# EAGLE design CDH-v4.11-A-DS1338-tcc-test-redesign (EAGLE 7.2.0)
sdf
DRAWING_AUTHOR: Lambert Le
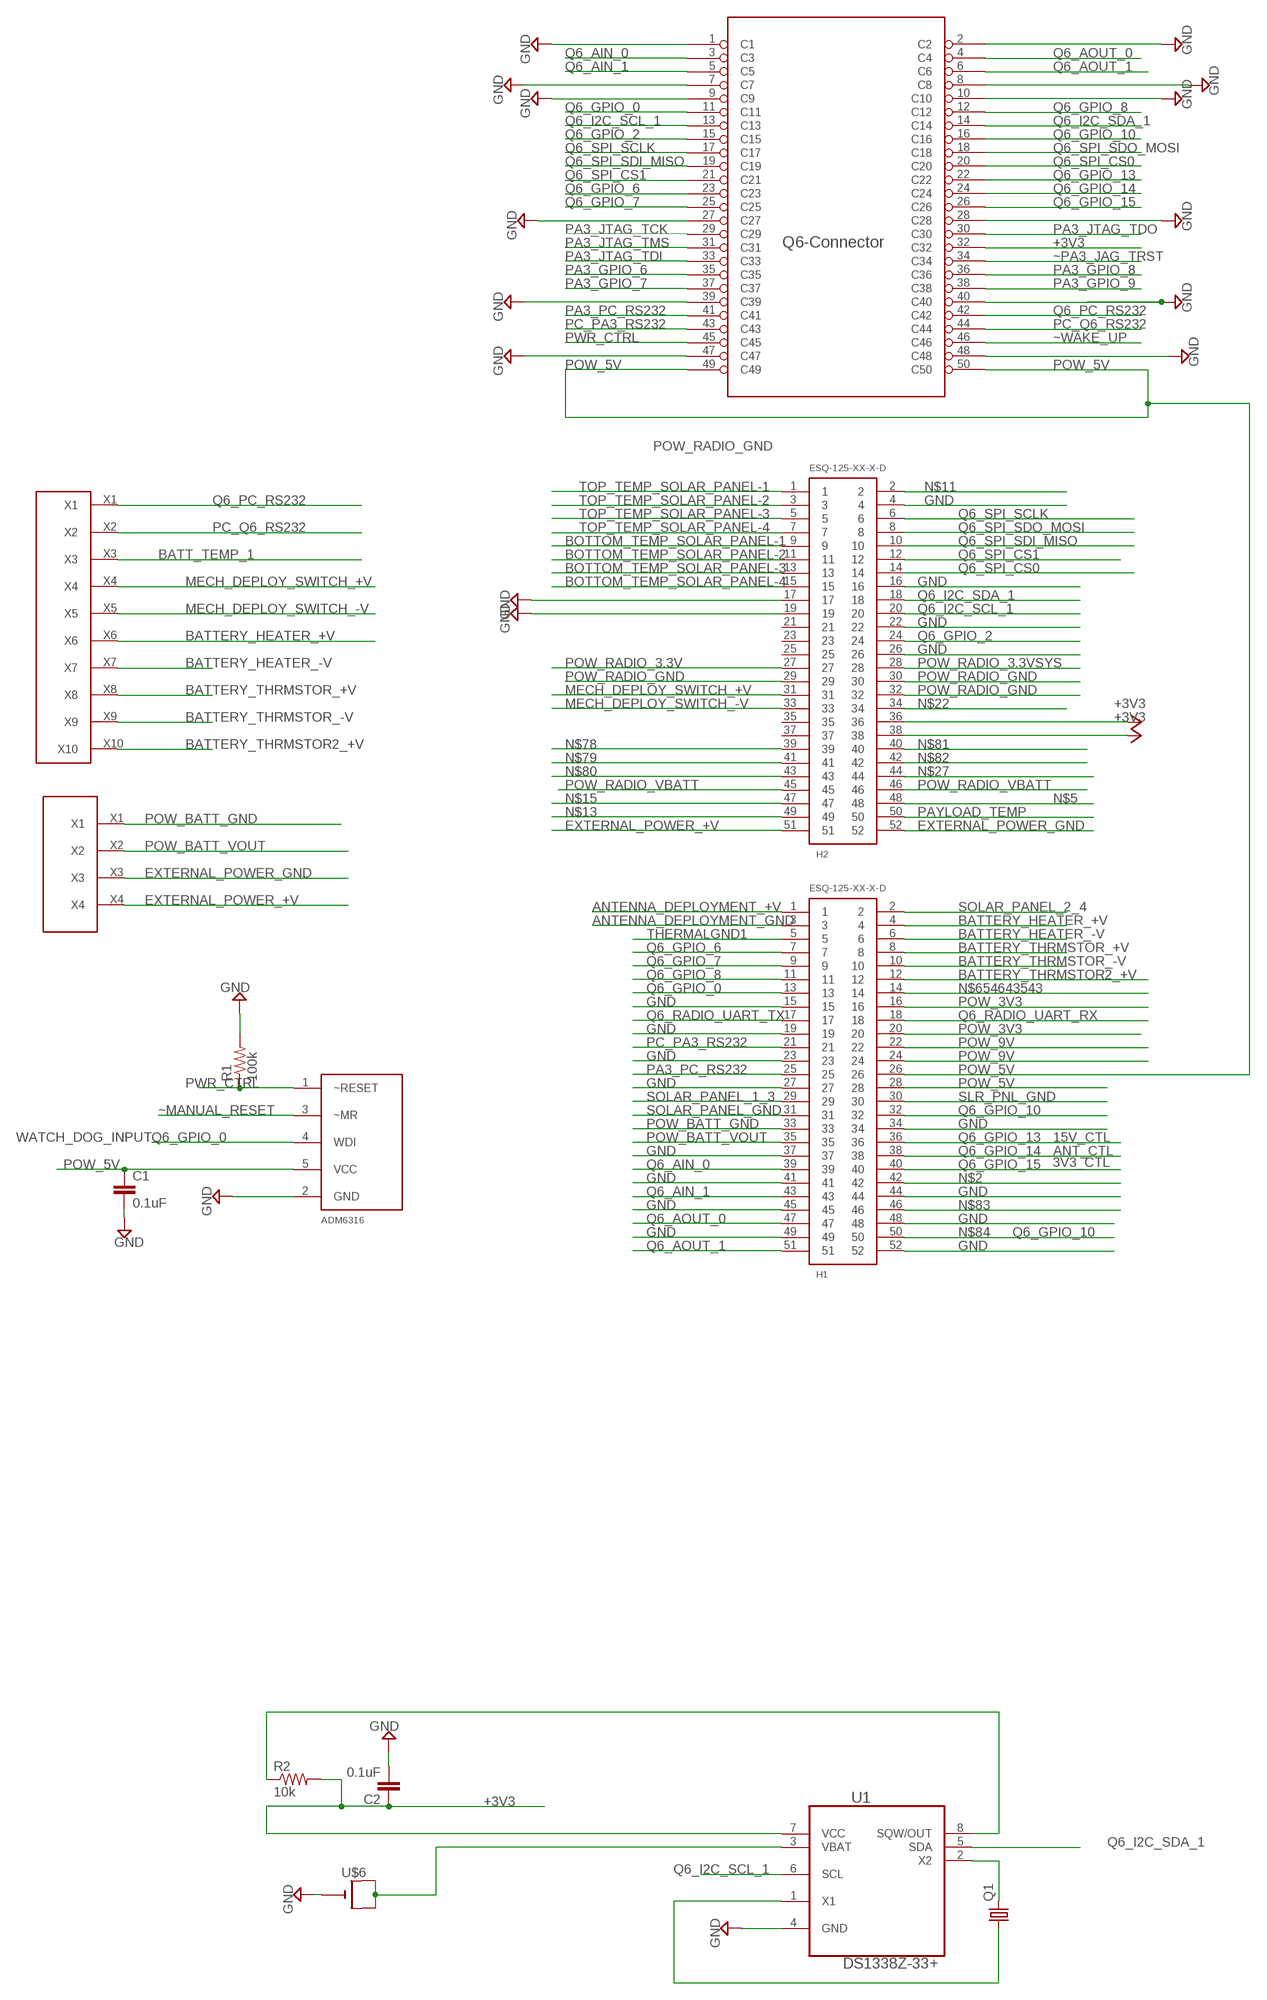
[diagram p0: schematic, sheet 1, part 1 of 2]
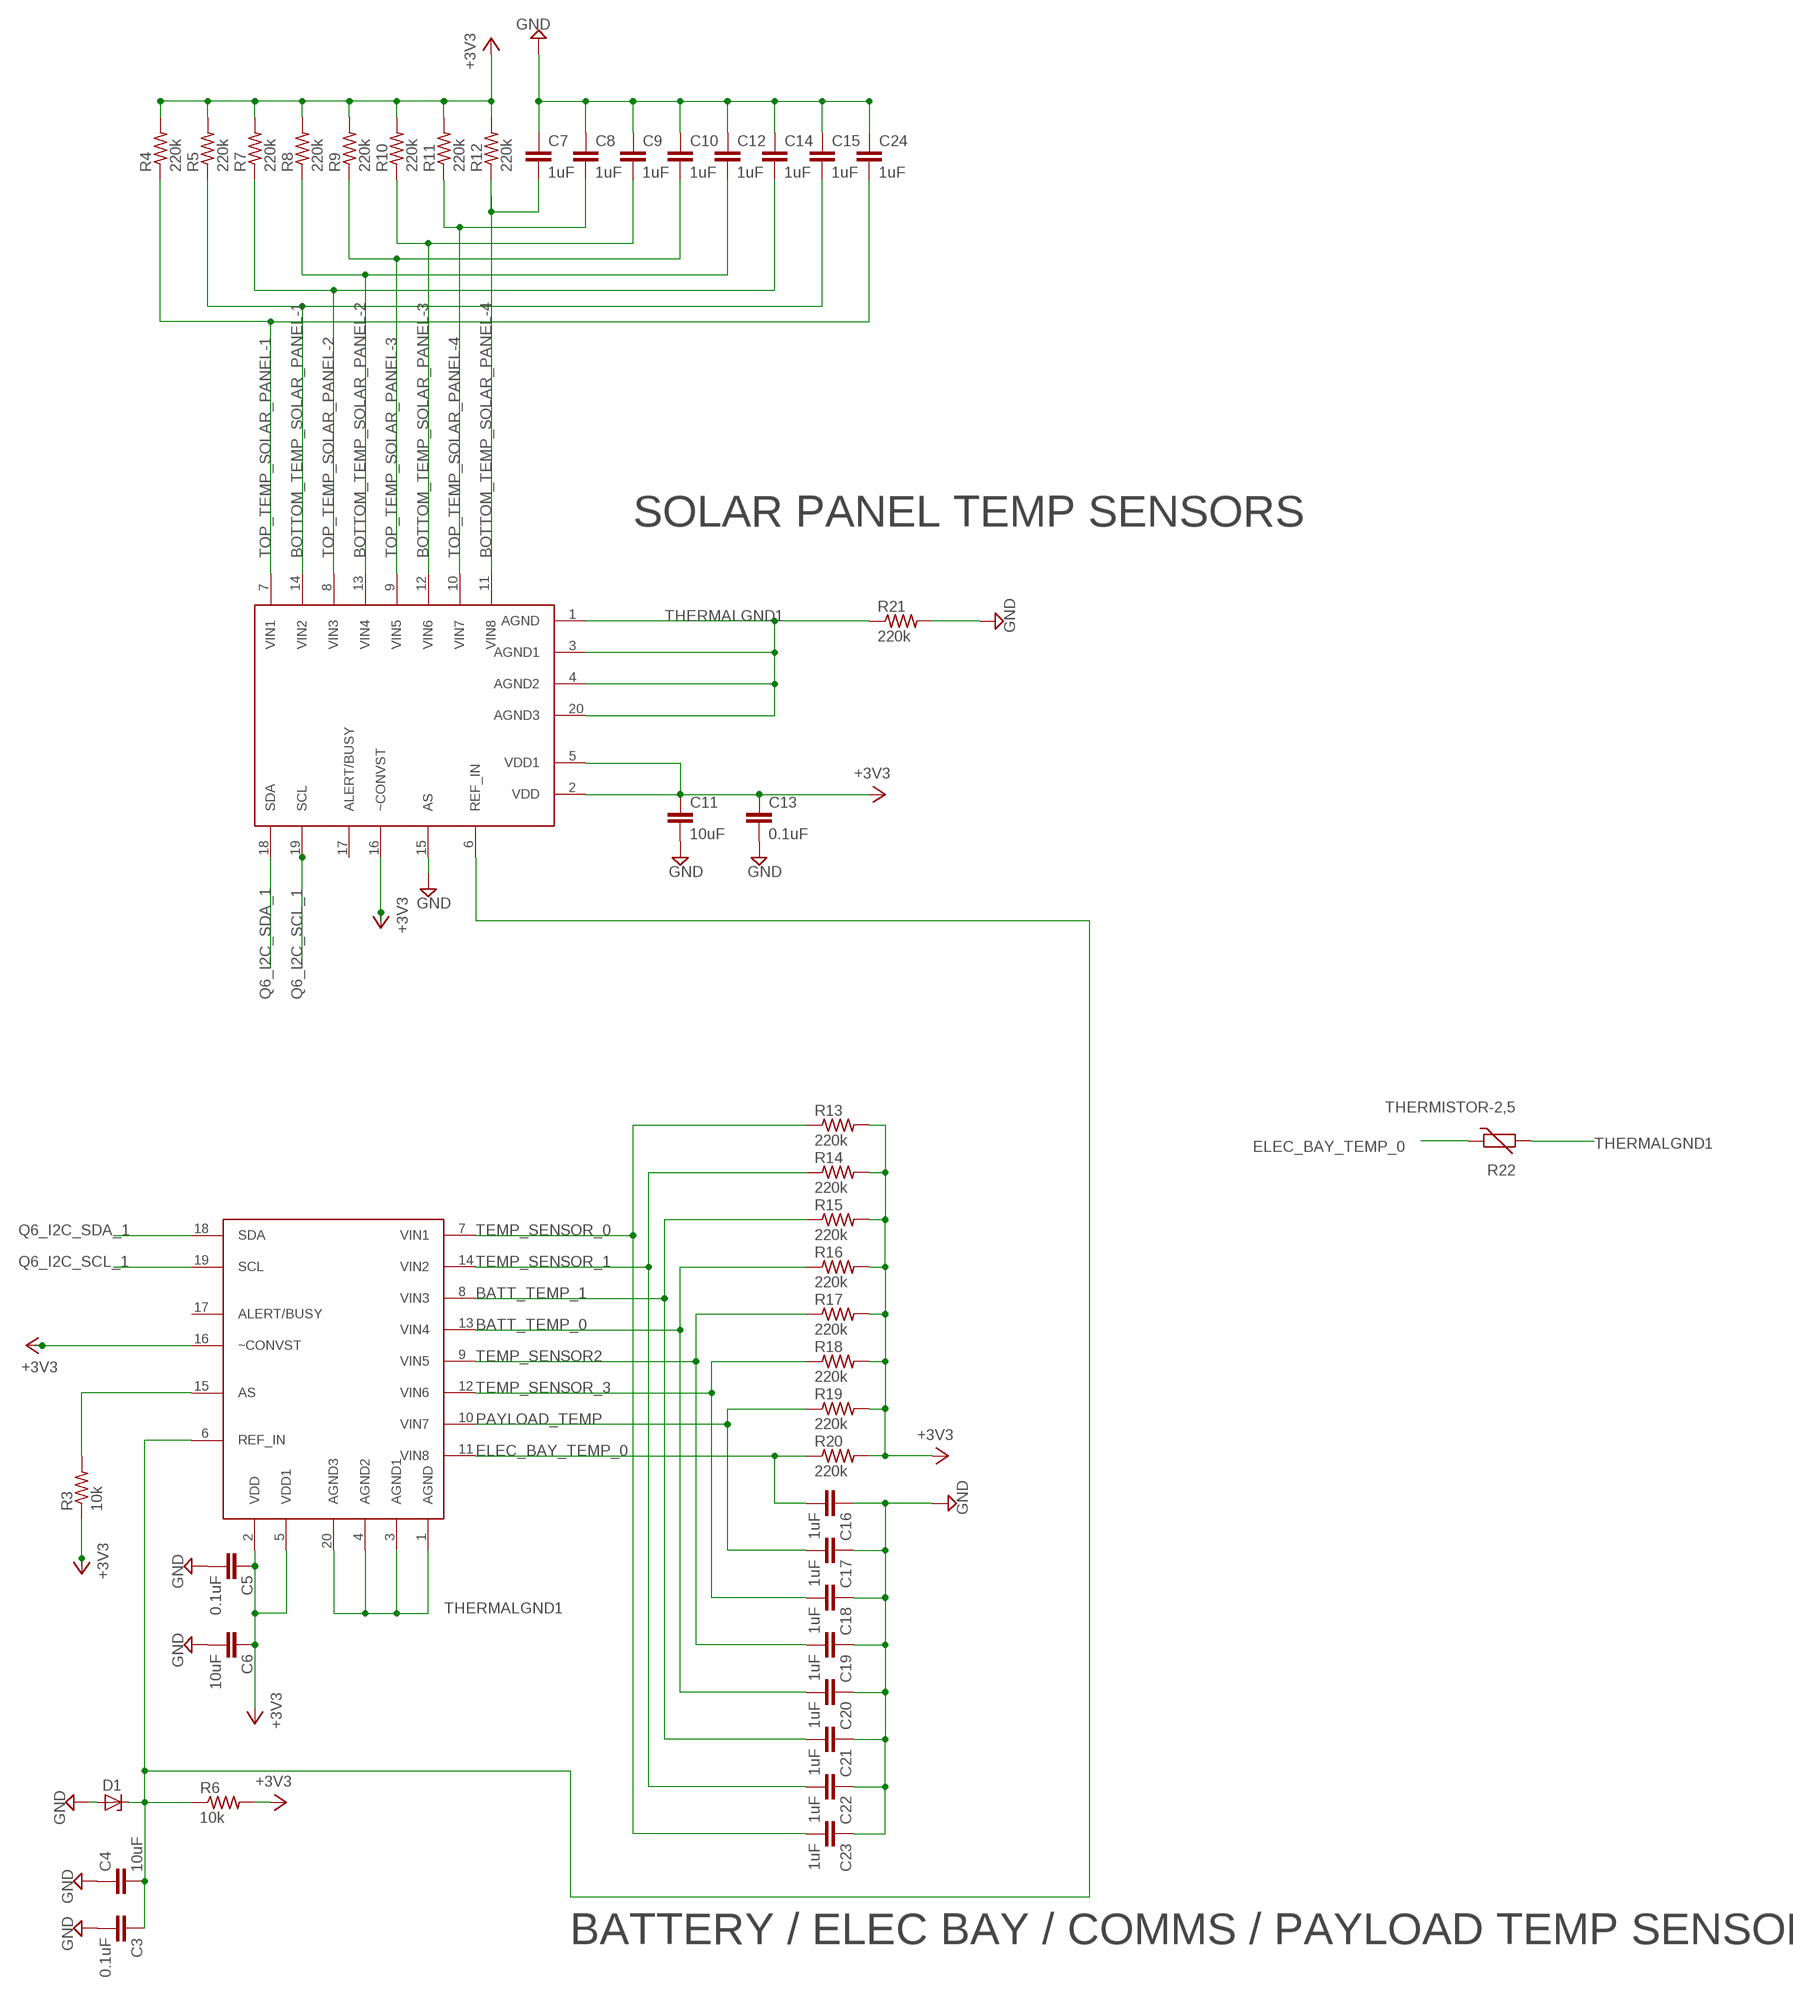
[diagram p1: schematic, sheet 1, part 2 of 2]

## Parts
ADC_TEMP_1  AD7998-1  [TSSOP20]
ADC_TEMP_2  AD7998-1  [TSSOP20]
C1  0.1uF  C-EUC2012  [C2012]
C2  0.1uF  C-EUC2012  [C2012]
C3  0.1uF  C-EUC2012  [C2012]
C4  10uF  C-EUC2012  [C2012]
C5  0.1uF  C-EUC2012  [C2012]
C6  10uF  C-EUC2012  [C2012]
C7  1uF  C-EUC2012  [C2012]
C8  1uF  C-EUC2012  [C2012]
C9  1uF  C-EUC2012  [C2012]
C10  1uF  C-EUC2012  [C2012]
C11  10uF  C-EUC2012  [C2012]
C12  1uF  C-EUC2012  [C2012]
C13  0.1uF  C-EUC2012  [C2012]
C14  1uF  C-EUC2012  [C2012]
C15  1uF  C-EUC2012  [C2012]
C16  1uF  C-EUC2012  [C2012]
C17  1uF  C-EUC2012  [C2012]
C18  1uF  C-EUC2012  [C2012]
C19  1uF  C-EUC2012  [C2012]
C20  1uF  C-EUC2012  [C2012]
C21  1uF  C-EUC2012  [C2012]
C22  1uF  C-EUC2012  [C2012]
C23  1uF  C-EUC2012  [C2012]
C24  1uF  C-EUC2012  [C2012]
D1  ZENER-DIODESOD80C  [SOD80C]
H1  ESQ-125-XX-X-D  [ESQ-125-XX-X-D]
H2  ESQ-125-XX-X-D  [ESQ-125-XX-X-D]
Q1  CRYSTALTC38H  [TC38H]
R1  100k  R-US_R2012  [R2012]
R2  10k  R-US_R2012  [R2012]
R3  10k  R-US_R2012  [R2012]
R4  220k  R-US_R2012  [R2012]
R5  220k  R-US_R2012  [R2012]
R6  10k  R-US_R2012  [R2012]
R7  220k  R-US_R2012  [R2012]
R8  220k  R-US_R2012  [R2012]
R9  220k  R-US_R2012  [R2012]
R10  220k  R-US_R2012  [R2012]
R11  220k  R-US_R2012  [R2012]
R12  220k  R-US_R2012  [R2012]
R13  220k  R-US_R2012  [R2012]
R14  220k  R-US_R2012  [R2012]
R15  220k  R-US_R2012  [R2012]
R16  220k  R-US_R2012  [R2012]
R17  220k  R-US_R2012  [R2012]
R18  220k  R-US_R2012  [R2012]
R19  220k  R-US_R2012  [R2012]
R20  220k  R-US_R2012  [R2012]
R21  220k  R-US_R2012  [R2012]
R22  THERMISTOR-2,5  [RS-2,5]
U1  DS1338Z-33+  [SOIC127P600X175-8N]
U$1  M80-5000000M1-10-331-00-000  [M80-5000000M1-04-331-00-000]
U$2  M80-5000000M1-10-331-000  [M80-5000000M1]
U$3  ADM6316/ADM6320  [SOT23-5]
U$4  SMFC  [SFMC-107-01-XX-D]
U$6  CR1220SMT  [CR1220-SMD]

## Nets
+3V3: ADC_TEMP_1.2(VDD) ADC_TEMP_1.5(VDD1) ADC_TEMP_1.16(~CONVST) ADC_TEMP_2.2(VDD) ADC_TEMP_2.5(VDD1) ADC_TEMP_2.16(~CONVST) C2.1 C5.1 C6.1 C11.1 C13.1 H2.36 H2.38 R2.2 R3.1 R4.2 R5.2 R6.2 R7.2 R8.2 R9.2 R10.2 R11.2 R12.2 R13.2 R14.2 R15.2 R16.2 R17.2 R18.2 R19.2 R20.2 U1.7(VCC) U$4.32(C32)
ANTENNA_DEPLOYMENT_+V: H1.1
ANTENNA_DEPLOYMENT_GND: H1.3
BATT_TEMP_0: ADC_TEMP_1.13(VIN4) C20.2 R16.1
BATT_TEMP_1: ADC_TEMP_1.8(VIN3) C21.2 R15.1 U$2.X3
BATTERY_HEATER_+V: H1.4 U$2.X6
BATTERY_HEATER_-V: H1.6 U$2.X7
BATTERY_THRMSTOR2_+V: H1.12 U$2.X10
BATTERY_THRMSTOR_+V: H1.8 U$2.X8
BATTERY_THRMSTOR_-V: H1.10 U$2.X9
BOTTOM_TEMP_SOLAR_PANEL-1: ADC_TEMP_2.14(VIN2) C15.2 H2.9 R5.1
BOTTOM_TEMP_SOLAR_PANEL-2: ADC_TEMP_2.13(VIN4) C12.2 H2.11 R8.1
BOTTOM_TEMP_SOLAR_PANEL-3: ADC_TEMP_2.12(VIN6) C9.2 H2.13 R10.1
BOTTOM_TEMP_SOLAR_PANEL-4: ADC_TEMP_2.11(VIN8) C7.2 H2.15 R12.1
ELEC_BAY_TEMP_0: ADC_TEMP_1.11(VIN8) C16.2 R20.1 R22.1
EXTERNAL_POWER_+V: H2.51 U$1.X4
EXTERNAL_POWER_GND: H2.52 U$1.X3
GND: ADC_TEMP_2.15(AS) C1.2 C2.2 C3.2 C4.1 C5.2 C6.2 C7.1 C8.1 C9.1 C10.1 C11.2 C12.1 C13.2 C14.1 C15.1 C16.1 C17.1 C18.1 C19.1 C20.1 C21.1 C22.1 C23.1 C24.1 D1.A H1.15 H1.19 H1.23 H1.27 H1.34 H1.37 H1.41 H1.44 H1.45 H1.48 H1.49 H1.52 H2.4 H2.16 H2.17 H2.19 H2.22 H2.26 R1.2 R21.2 U1.4(GND) U$3.2(GND) U$4.1(C1) U$4.2(C2) U$4.7(C7) U$4.8(C8) U$4.9(C9) U$4.10(C10) U$4.27(C27) U$4.28(C28) U$4.39(C39) U$4.40(C40) U$4.47(C47) U$4.48(C48) U$6.-
MECH_DEPLOY_SWITCH_+V: H2.31 U$2.X4
MECH_DEPLOY_SWITCH_-V: H2.33 U$2.X5
N$2: H1.42
N$3: ADC_TEMP_1.15(AS) R3.2
N$5: H2.48
N$7: R2.1 U1.8(SQW/OUT)
N$8: U1.3(VBAT) U$6.+$1(+) U$6.+$2(+1)
N$11: H2.2
N$12: Q1.1 U1.1(X1)
N$13: H2.49
N$15: H2.47
N$18: Q1.2 U1.2(X2)
N$22: H2.34
N$27: H2.44
N$78: H2.39
N$79: H2.41
N$80: H2.43
N$81: H2.40
N$82: H2.42
N$83: H1.46
N$84: H1.50
N$654643543: H1.14
PA3_GPIO_6: U$4.35(C35)
PA3_GPIO_7: U$4.37(C37)
PA3_GPIO_8: U$4.36(C36)
PA3_GPIO_9: U$4.38(C38)
PA3_JTAG_TCK: U$4.29(C29)
PA3_JTAG_TDI: U$4.33(C33)
PA3_JTAG_TDO: U$4.30(C30)
PA3_JTAG_TMS: U$4.31(C31)
PA3_PC_RS232: H1.25 U$4.41(C41)
PAYLOAD_TEMP: ADC_TEMP_1.10(VIN7) C17.2 H2.50 R19.1
PC_PA3_RS232: H1.21 U$4.43(C43)
PC_Q6_RS232: U$2.X2 U$4.44(C44)
POW_3V3: H1.16 H1.20
POW_5V: C1.1 H1.26 H1.28 U$3.5(VCC) U$4.49(C49) U$4.50(C50)
POW_9V: H1.22 H1.24
POW_BATT_GND: H1.33 U$1.X1
POW_BATT_VOUT: H1.35 U$1.X2
POW_RADIO_3.3V: H2.27
POW_RADIO_3.3VSYS: H2.28
POW_RADIO_GND: H2.29 H2.30 H2.32
POW_RADIO_VBATT: H2.45 H2.46
PWR_CTRL: R1.1 U$3.1(~RESET) U$4.45(C45)
Q6_AIN_0: H1.39 U$4.3(C3)
Q6_AIN_1: H1.43 U$4.5(C5)
Q6_AOUT_0: H1.47 U$4.4(C4)
Q6_AOUT_1: H1.51 U$4.6(C6)
Q6_GPIO_0: H1.13 U$3.4(WDI) U$4.11(C11)
Q6_GPIO_2: H2.24 U$4.15(C15)
Q6_GPIO_6: H1.7 U$4.23(C23)
Q6_GPIO_7: H1.9 U$4.25(C25)
Q6_GPIO_8: H1.11 U$4.12(C12)
Q6_GPIO_10: H1.32 U$4.16(C16)
Q6_GPIO_13: H1.36 U$4.22(C22)
Q6_GPIO_14: H1.38 U$4.24(C24)
Q6_GPIO_15: H1.40 U$4.26(C26)
Q6_I2C_SCL_1: ADC_TEMP_1.19(SCL) ADC_TEMP_2.19(SCL) H2.20 U1.6(SCL) U$4.13(C13)
Q6_I2C_SDA_1: ADC_TEMP_1.18(SDA) ADC_TEMP_2.18(SDA) H2.18 U1.5(SDA) U$4.14(C14)
Q6_PC_RS232: U$2.X1 U$4.42(C42)
Q6_RADIO_UART_RX: H1.18
Q6_RADIO_UART_TX: H1.17
Q6_SPI_CS0: H2.14 U$4.20(C20)
Q6_SPI_CS1: H2.12 U$4.21(C21)
Q6_SPI_SCLK: H2.6 U$4.17(C17)
Q6_SPI_SDI_MISO: H2.10 U$4.19(C19)
Q6_SPI_SDO_MOSI: H2.8 U$4.18(C18)
REF_IN: ADC_TEMP_1.6(REF_IN) ADC_TEMP_2.6(REF_IN) C3.1 C4.2 D1.C R6.1
SLR_PNL_GND: H1.30
SOLAR_PANEL_1_3: H1.29
SOLAR_PANEL_2_4: H1.2
SOLAR_PANEL_GND: H1.31
TEMP_SENSOR2: ADC_TEMP_1.9(VIN5) C19.2 R17.1
TEMP_SENSOR_0: ADC_TEMP_1.7(VIN1) C23.2 R13.1
TEMP_SENSOR_1: ADC_TEMP_1.14(VIN2) C22.2 R14.1
TEMP_SENSOR_3: ADC_TEMP_1.12(VIN6) C18.2 R18.1
THERMALGND1: ADC_TEMP_1.1(AGND) ADC_TEMP_1.3(AGND1) ADC_TEMP_1.4(AGND2) ADC_TEMP_1.20(AGND3) ADC_TEMP_2.1(AGND) ADC_TEMP_2.3(AGND1) ADC_TEMP_2.4(AGND2) ADC_TEMP_2.20(AGND3) H1.5 R21.1 R22.2
TOP_TEMP_SOLAR_PANEL-1: ADC_TEMP_2.7(VIN1) C24.2 H2.1 R4.1
TOP_TEMP_SOLAR_PANEL-2: ADC_TEMP_2.8(VIN3) C14.2 H2.3 R7.1
TOP_TEMP_SOLAR_PANEL-3: ADC_TEMP_2.9(VIN5) C10.2 H2.5 R9.1
TOP_TEMP_SOLAR_PANEL-4: ADC_TEMP_2.10(VIN7) C8.2 H2.7 R11.1
~MANUAL_RESET: U$3.3(~MR)
~PA3_JAG_TRST: U$4.34(C34)
~WAKE_UP: U$4.46(C46)
Unconnected: ADC_TEMP_1.17(ALERT/BUSY) ADC_TEMP_2.17(ALERT/BUSY) H2.21 H2.23 H2.25 H2.35 H2.37

## Notes on the sheet
- Q6_AOUT_0
- Q6_AOUT_1
- Q6-Connector
- SOLAR PANEL TEMP SENSORS
- POW_RADIO_GND
- SOLAR_PANEL_2_4
- WATCH_DOG_INPUT | 15V_CTL
- ANT_CTL
- 3V3_CTL
- Q6_GPIO_10
- BATTERY / ELEC BAY / COMMS / PAYLOAD TEMP SENSORS

## Library data of the parts
ADC_TEMP_1 ADC_TEMP_2 = analog-devices:AD7998-1
C1-C24 = rcl:C-EU: CAPACITOR, European symbol
D1 = diode:ZENER-DIODE: Z-Diode
H1 H2 = ESQ-126-XX-X-D:ESQ-125-XX-X-D: ELEVATED SOCKET, .100 inch(2.54mm) PITCH
Q1 = adafruit:CRYSTAL: CRYSTAL; OC_FARNELL: unknown; OC_NEWARK: unknown
R1-R21 = resistor:R-US_: RESISTOR, American symbol
R22 = varistor:THERMISTOR: THERMISTOR
U1 = Maxim_By_element14_Batch_1:DS1338Z-33+: I2C RTC with 56-Byte NV RAM; MPN: DS1338Z-33+; OC_FARNELL: 1379714; OC_NEWARK: 27K7425; PACKAGE: SOIC-8; SUPPLIER: Maxim
U$1 = harwin:M80-5000000M1-10-331-00-000
U$2 = harwin:M80-5000000M1-10-331-000
U$3 = analog-devices:ADM6316/ADM6320
U$4 = SFMC-125-02-S-D:SMFC
U$6 = adafruit:CR1220: CR1216/CR1220/CR1225 12mm 3V lithium coin cell Great for battery packup. Both SMT and THM holders. Note the THM package has the ground pads on both sides of the PCB so that the masks are the same - this reduces the cost

## Net classes
0 default: width 0.406 mm

## Board
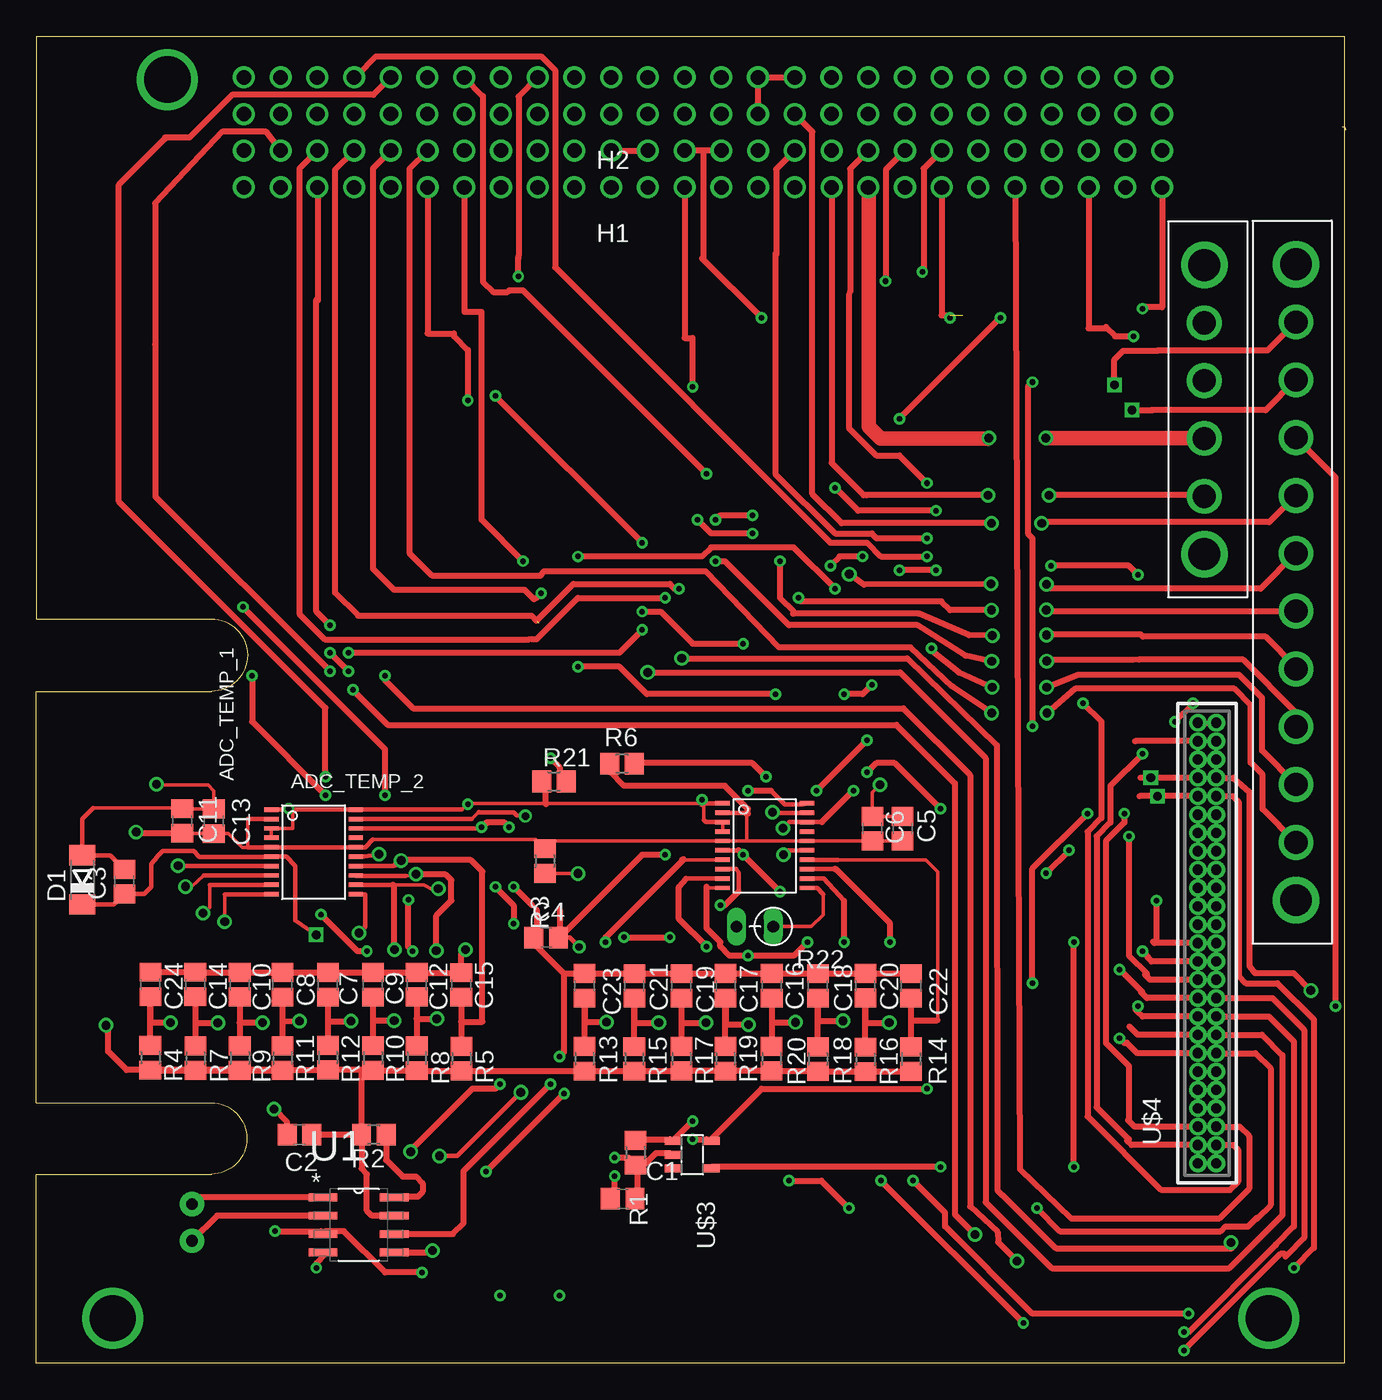
[diagram p2: board, top side]
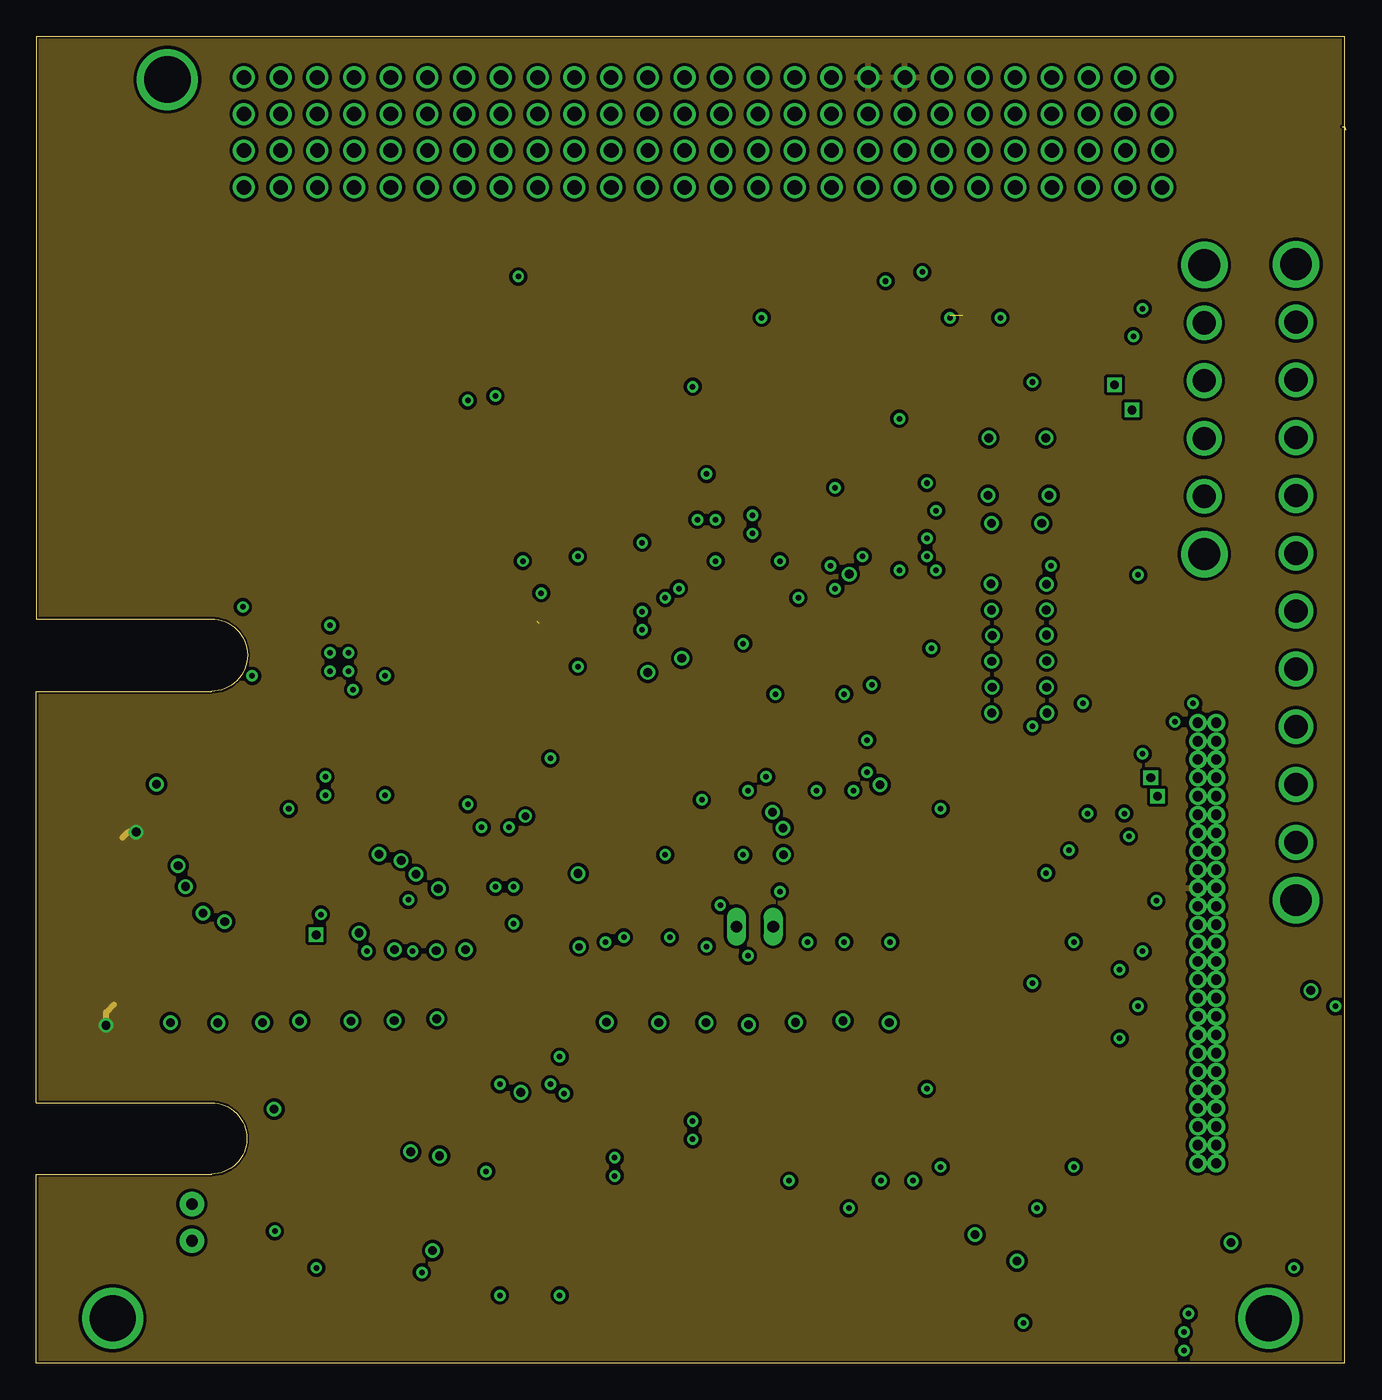
[diagram p3: board, inner layer +3V3]
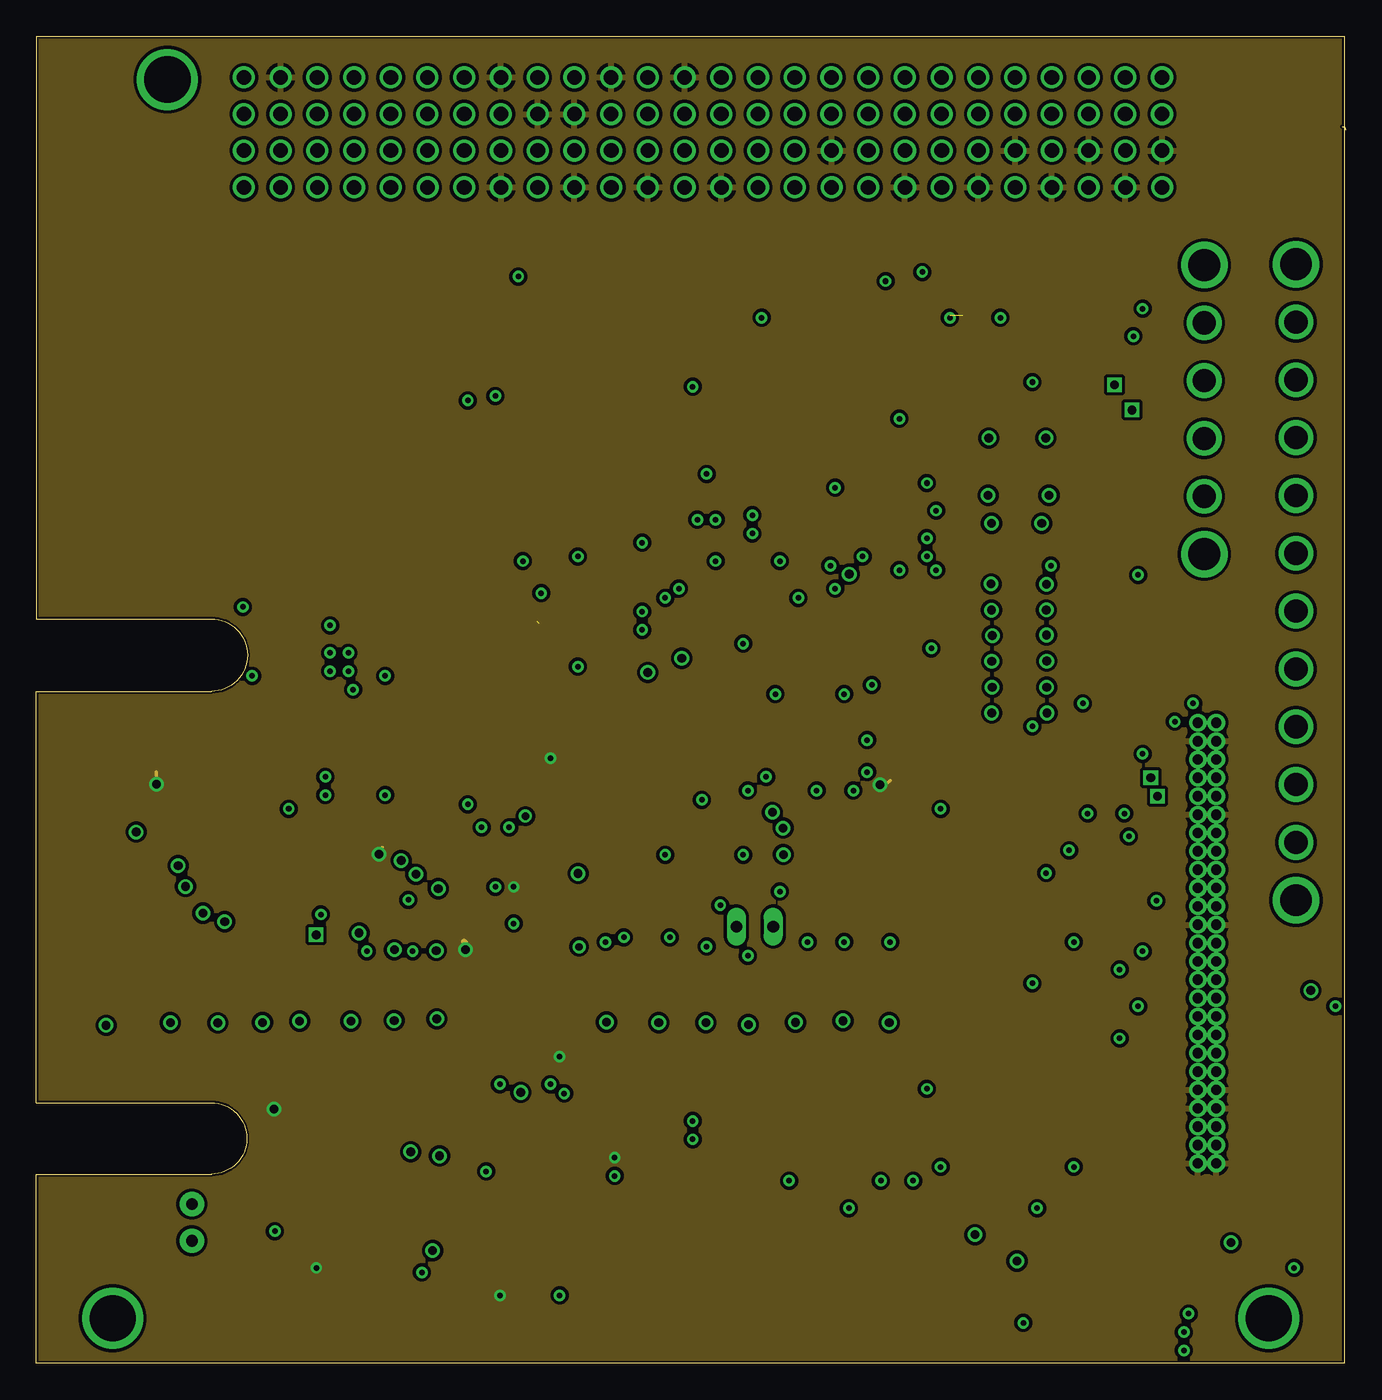
[diagram p4: board, inner layer GND]
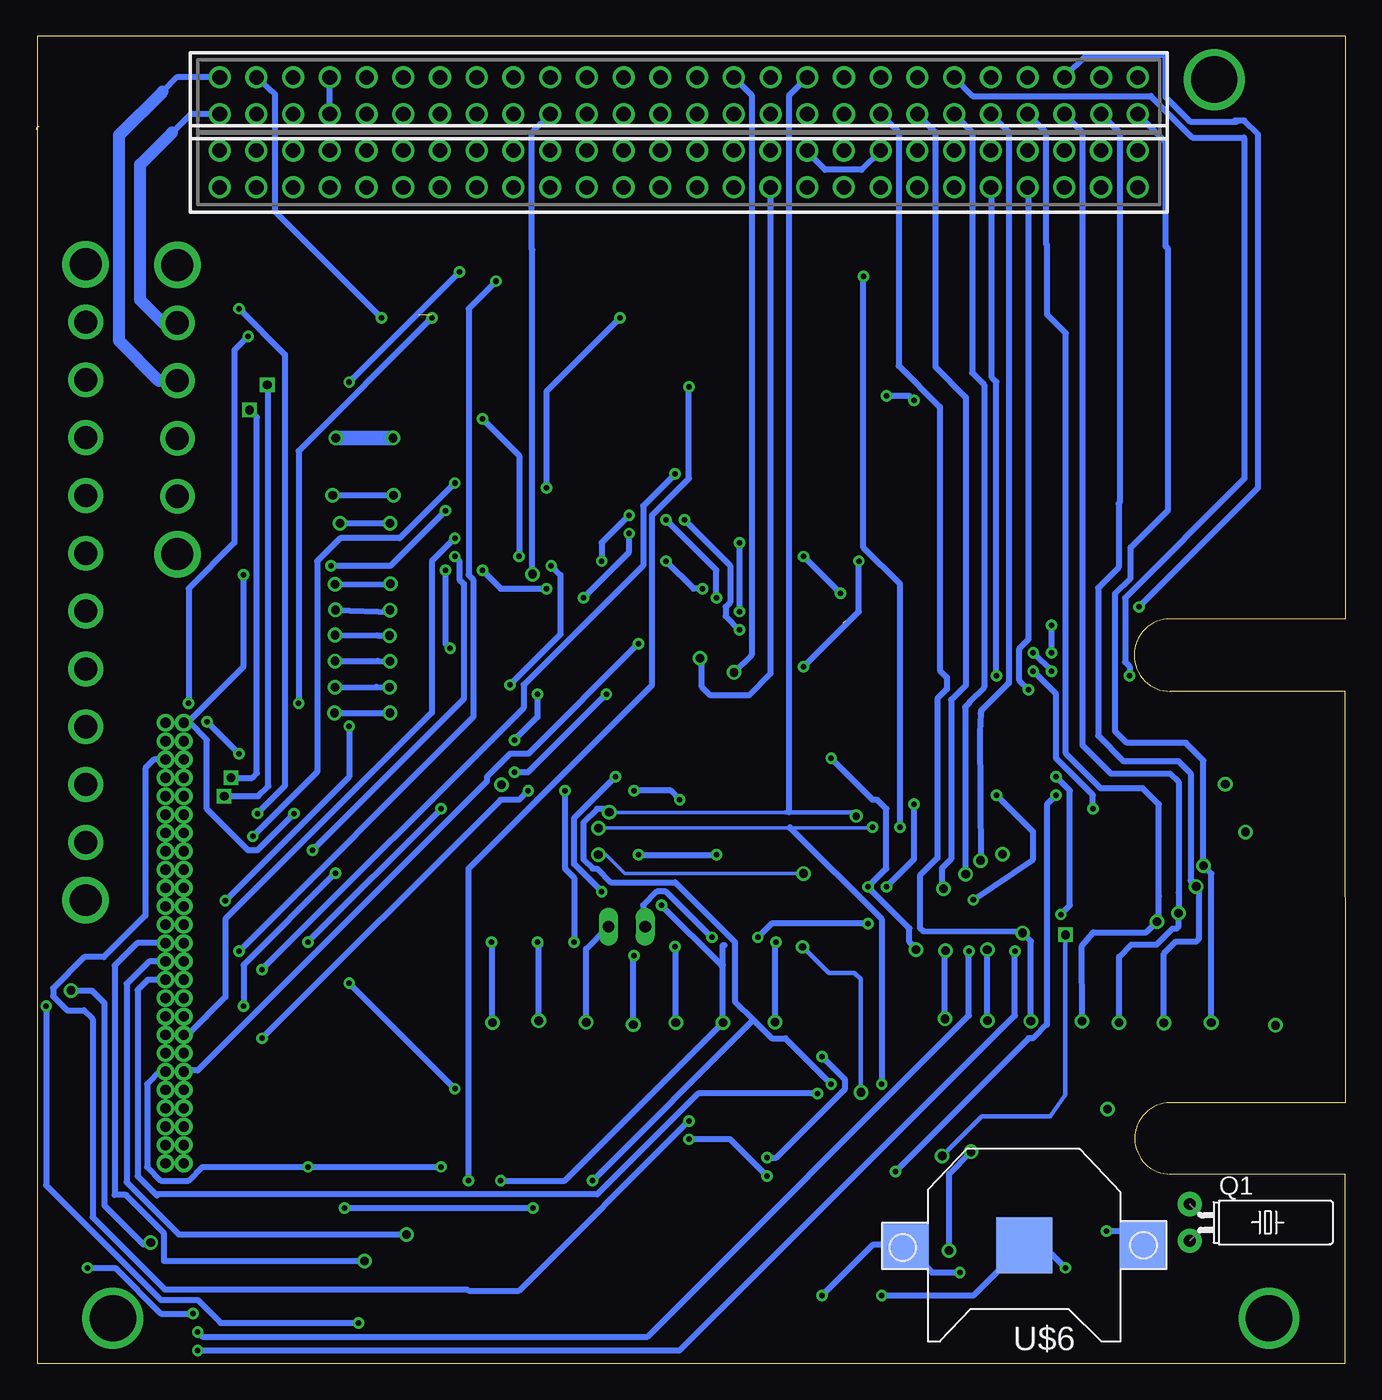
[diagram p5: board, bottom side, seen from below]

Size 90.56 x 91.83 mm. Coordinates in mm from the lower left corner, seen from the top.
Outline: 0.01,51.5 12.13,51.5
Outline: 12.14,46.5 0.01,46.5 0,18.03 12.13,18.03
Outline: 12.14,13.09 0.01,13.09 0.01,0 90.48,0 90.48,91.83 0.01,91.83 0.01,51.5
Outline: 12.12,51.5 arc-180 12.11,46.49
Outline: 12.11,18.03 arc-180 12.09,13.09
Outline: 90.34,85.56 arc-90 90.56,85.35
Copper layers (1*2+15*16): Top 0.035mm / dielectric 0.5mm / +3V3 0.035mm / dielectric 0.5mm / GND 0.035mm / dielectric 0.5mm / Bottom 0.035mm
Design rules "4pcb": minimum track width 6mil, minimum drill 15mil, track to track 9mil, track to pad 9mil, pad to pad 9mil, via to via 9mil, smd to smd 9mil, copper to edge 6mil, drill to drill 6mil, minimum pad ring 10mil, minimum via ring 8mil, stop-mask expansion 4mil, vias tented up to drill 0mil, thermal gap 10mil

### Footprints (pad centres in the part's own frame; a part is rotated, then mirrored left to right if it is on the bottom)
TSSOP20 = smd 0.305 x 0.991: 1 -3.575,-2.918; 2 -2.925,-2.918; 3 -2.275,-2.918; 4 -1.625,-2.918; 5 -0.975,-2.918; 6 -0.325,-2.918; 7 0.325,-2.918; 8 0.975,-2.918; 9 1.625,-2.918; 10 2.275,-2.918; 11 2.275,2.918; 12 1.625,2.918; 13 0.975,2.918; 14 0.325,2.918; 15 -0.325,2.918; 16 -0.975,2.918; 17 -1.625,2.918; 18 -2.275,2.918; 19 -2.925,2.918; 20 -3.575,2.918
C2012 = smd 1.3 x 1.5: 1 -0.85,0; 2 0.85,0
SOD80C = smd 1.4 x 1.8: A 1.7,0; C -1.7,0
ESQ-125-XX-X-D = drill 1.016 pad 1.524: 1 -27.94,-1.27; 2 -27.94,1.27; 3 -25.4,-1.27; 4 -25.4,1.27; 5 -22.86,-1.27; 6 -22.86,1.27; 7 -20.32,-1.27; 8 -20.32,1.27; 9 -17.78,-1.27; 10 -17.78,1.27; 11 -15.24,-1.27; 12 -15.24,1.27; 13 -12.7,-1.27; 14 -12.7,1.27; 15 -10.16,-1.27; 16 -10.16,1.27; 17 -7.62,-1.27; 18 -7.62,1.27; 19 -5.08,-1.27; 20 -5.08,1.27; 21 -2.54,-1.27; 22 -2.54,1.27; 23 0,-1.27; 24 0,1.27; 25 2.54,-1.27; 26 2.54,1.27; 27 5.08,-1.27; 28 5.08,1.27; 29 7.62,-1.27; 30 7.62,1.27; 31 10.16,-1.27; 32 10.16,1.27; 33 12.7,-1.27; 34 12.7,1.27; 35 15.24,-1.27; 36 15.24,1.27; 37 17.78,-1.27; 38 17.78,1.27; 39 20.32,-1.27; 40 20.32,1.27; 41 22.86,-1.27; 42 22.86,1.27; 43 25.4,-1.27; 44 25.4,1.27; 45 27.94,-1.27; 46 27.94,1.27; 47 30.48,-1.27; 48 30.48,1.27; 49 33.02,-1.27; 50 33.02,1.27; 51 35.56,-1.27; 52 35.56,1.27
TC38H = drill 0.813 pad 1.676: 1 -1.27,0; 2 1.27,0
R2012 = smd 1.3 x 1.5: 1 -0.85,0; 2 0.85,0
RS-2,5 = drill 0.813 long: 1 -1.27,0; 2 1.27,0
SOIC127P600X175-8N = smd 1.981 x 0.533: 1 -2.464,1.905; 2 -2.464,0.635; 3 -2.464,-0.635; 4 -2.464,-1.905; 5 2.464,-1.905; 6 2.464,-0.635; 7 2.464,0.635; 8 2.464,1.905
M80-5000000M1-04-331-00-000 = drill 2.2: P$11 -10,0; P$12 10,0 | drill 1.6: X1 -6,0; X2 -2,0; X3 2,0; X4 6,0
M80-5000000M1 = drill 2.2: P$11 -22,0; P$12 22,0 | drill 1.6: X1 -18,0; X2 -14,0; X3 -10,0; X4 -6,0; X5 -2,0; X6 2,0; X7 6,0; X8 10,0; X9 14,0; X10 18,0
SOT23-5 = smd 0.55 x 1.2: 1 -0.95,-1.3; 2 0,-1.3; 3 0.95,-1.3; 4 0.95,1.3; 5 -0.95,1.3
SFMC-107-01-XX-D = drill 0.711 pad 1.067: 1 -15.875,-0.635; 2 -15.875,0.635; 3 -14.605,-0.635; 4 -14.605,0.635; 5 -13.335,-0.635; 6 -13.335,0.635; 7 -12.065,-0.635; 8 -12.065,0.635; 9 -10.795,-0.635; 10 -10.795,0.635; 11 -9.525,-0.635; 12 -9.525,0.635; 13 -8.255,-0.635; 14 -8.255,0.635; 15 -6.985,-0.635; 16 -6.985,0.635; 17 -5.715,-0.635; 18 -5.715,0.635; 19 -4.445,-0.635; 20 -4.445,0.635; 21 -3.175,-0.635; 22 -3.175,0.635; 23 -1.905,-0.635; 24 -1.905,0.635; 25 -0.635,-0.635; 26 -0.635,0.635; 27 0.635,-0.635; 28 0.635,0.635; 29 1.905,-0.635; 30 1.905,0.635; 31 3.175,-0.635; 32 3.175,0.635; 33 4.445,-0.635; 34 4.445,0.635; 35 5.715,-0.635; 36 5.715,0.635; 37 6.985,-0.635; 38 6.985,0.635; 39 8.255,-0.635; 40 8.255,0.635; 41 9.525,-0.635; 42 9.525,0.635; 43 10.795,-0.635; 44 10.795,0.635; 45 12.065,-0.635; 46 12.065,0.635; 47 13.335,-0.635; 48 13.335,0.635; 49 14.605,-0.635; 50 14.605,0.635
CR1220-SMD = smd 3.2 x 3.2: +$1 -8.2,0; +$2 8.2,0 | smd 3.9 x 3.9: - 0,0

### Placement (x,y rotation side)
ADC_TEMP_1  50.39,35.17 270 top
ADC_TEMP_2  19.19,34.73 270 top
C1  40.56,11.39 0 top
C2  18.21,15.83 180 top
C3  6.1,33.33 90 top
C4  35.27,29.46 0 top
C5  59.92,36.99 90 top
C6  57.84,36.99 90 top
C7  20.18,26.19 270 top
C8  17.03,26.19 270 top
C9  23.29,26.19 270 top
C10  14.08,26.2 270 top
C11  10.11,37.53 90 top
C12  26.32,26.2 270 top
C13  12.29,37.5 90 top
C14  11.01,26.22 270 top
C15  29.4,26.18 270 top
C16  50.88,26.12 270 top
C17  47.68,26.12 270 top
C18  54.07,26.12 270 top
C19  44.63,26.11 270 top
C20  57.35,26.13 270 top
C21  41.37,26.11 270 top
C22  60.51,26.12 270 top
C23  37.93,26.12 270 top
C24  7.9,26.22 270 top
D1  3.19,33.45 90 top
H1  42.31,82.64 0 top
H2  42.3,87.7 0 top
Q1  10.77,9.75 270 bottom
R1  41.44,14.57 270 top
R2  23.35,15.82 180 top
R3  35.19,34.75 270 top
R4  7.9,21.15 270 top
R5  29.41,21.08 270 top
R6  40.51,41.49 180 top
R7  11.02,21.12 270 top
R8  26.32,21.11 270 top
R9  14.09,21.12 270 top
R10  23.3,21.13 270 top
R11  17.05,21.12 270 top
R12  20.18,21.15 270 top
R13  37.93,21.07 270 top
R14  60.51,21.06 270 top
R15  41.36,21.07 270 top
R16  57.35,21.04 270 top
R17  44.64,21.08 270 top
R18  54.06,21.05 270 top
R19  47.67,21.07 270 top
R20  50.87,21.08 270 top
R21  35.81,40.26 0 top
R22  49.71,30.22 180 top
U1  22.3,9.59 0 top
U$1  80.79,65.99 90 top
U$2  87.13,54.05 270 top
U$3  45.37,14.43 270 top
U$4  80.98,29.71 90 top
U$6  22.22,8.17 180 bottom

### Tracks (layer width: path | path; a pad name or v marks a point on that pad's centre or on a via)
+3V3  (via drill 0.6)
  Top 0.254: ADC_TEMP_1.5 ADC_TEMP_1.16 C6.1 C5.1 | C11.1 10.13,36.65 C13.1 13.29,36.66 14.24,35.71 14.64,35.71 14.64,37.66 | ADC_TEMP_1.5 49.13,36.14 49.13,38.04 49.13,38.09 | ADC_TEMP_1.2 | 23.28,36.23 34.55,36.23 R3.1 35.73,36.14 ADC_TEMP_1.5
  Top 0.305: 14.64,35.71 ADC_TEMP_2.5 ADC_TEMP_2.16 22.75,35.71 23.28,36.23 | ADC_TEMP_2.2 14.64,37.66 | 49.13,38.09 ADC_TEMP_1.2
  Top 0.406: R4.2 7.9,20.27 R7.2 R9.2 R11.2 17.05,20.3 | 17.05,20.3 R12.2 22.61,20.3 | 22.61,20.3 23.3,20.3 R10.2 23.3,20.26 R8.2 26.32,20.23 R5.2 R13.2 R15.2 R17.2 R19.2 R20.2 54.03,20.23 R18.2 57.34,20.2 R16.2 60.49,20.19 R14.2 | 17.05,20.3 6.26,20.3 4.98,21.58 4.98,23.25 v4.84,23.39 | 10.13,36.65 7.03,36.65 v6.92,36.76 | R6.2 39.7,41.22 39.7,40.9 40.65,39.95 47.63,39.95 49.22,38.36 49.22,38.04 49.13,38.04 | C2.1 22.49,15.83 R2.2 | R2.2 22.5,20.19 22.61,20.3 | R2.2 22.5,13.48 22.88,13.1 22.88,10.56 23.22,10.22 U1.7
  +3V3 0.406: v4.84,23.39 4.84,24.29 5.38,24.83 | v6.92,36.76 6.38,36.76 5.97,36.35
  pour +3V3: 0.17,91.9 90.99,91.9 90.99,-0.46 0.2,-0.46
BATT_TEMP_0  (via drill 0.38, 0.6)
  Top 0.254: 55.25,34.19 55.31,34.19 55.44,34.07
  Top 0.305: ADC_TEMP_1.13 55.25,34.19
  Top 0.406: R16.1 C20.2 57.35,23.57 v59,23.57 | v59.06,29.15 59.06,30.42 55.25,34.23 55.25,34.19
  Bottom 0.406: v59,23.57 59,28.99 | 59,28.99 58.95,28.99 | v59.06,29.15 59,28.99
BATT_TEMP_1  (via drill 0.38, 0.6)
  Top 0.305: 48.59,32.65 48.59,33.92 48.41,34.19 47.77,34.19 ADC_TEMP_1.8
  Top 0.406: R15.1 C21.2 41.37,23.57 v43.06,23.57 | 48.59,32.65 47.63,31.69 v47.31,31.69 | v68.27,2.8 v58.43,12.64 | v89.86,24.71 89.86,61.31 U$2.X3
  Bottom 0.406: 43.06,27.57 v43.06,23.57 43.19,23.44 53.98,12.64 v58.43,12.64 | 43.06,27.57 43.06,28.94 42.96,28.94 | v47.31,31.69 43.19,27.57 43.06,27.57 | v68.27,2.8 77.79,2.8 79.38,4.39 81.92,4.39 89.86,12.33 v89.86,24.71
BATTERY_HEATER_+V  (via drill 0.38, 0.6)
  Top 0.406: H1.4 15.92,85.2 12.86,85.2 8.22,80.26 8.22,70.49 8.26,70.43 8.26,59.95 v20.33,47.89 | U$2.X6 87.11,52.02 69.91,52.02 v69.86,52.12 | v66.07,52.12 63.21,52.12 62.61,52.71 52.85,52.71 52.74,52.82 v52.71,52.97 | v21.6,49.16 40.33,49.16 v41.92,50.74 | v45.73,58.36 46.68,57.41 v49.54,57.41
  Bottom 0.406: v69.86,52.12 65.88,51.99 v66.07,52.12 | v21.6,49.16 v20.33,47.89 | v41.92,50.74 42.87,51.7 42.87,52.33 42.55,52.65 42.55,55.19 v45.73,58.36 | v49.54,57.41 49.54,56.14 v52.71,52.97
BATTERY_HEATER_-V  (via drill 0.38, 0.6)
  Top 0.406: H1.6 18.2,82.65 18.2,51.85 19.97,50.08 34.1,50.08 34.3,50.11 34.62,50.11 37.47,52.97 v43.51,52.97 | U$2.X7 87.13,48.17 85.02,50.28 76.55,50.28 76.39,50.44 69.99,50.44 v69.88,50.39 | v66.13,50.35 64.5,50.38 61.02,51.87 52.4,51.87 | 52.4,51.87 52.35,51.87 | v51.44,55.51 51.44,52.97 52.4,52.01 52.4,51.87 | v49.54,58.68 47.31,58.68 v47,58.36
  Bottom 0.406: v69.88,50.39 66.98,50.36 v66.13,50.35 | v51.44,55.51 51.44,56.78 v49.54,58.68 | v47,58.36 43.51,54.87 v43.51,52.97
BATTERY_THRMSTOR2_+V  (via drill 0.6)
  Top 0.406: H1.12 25.81,82.64 25.81,56.08 27.36,54.52 34.85,54.52 | 34.85,54.52 34.92,54.52 | U$2.X10 84.83,38.35 84.83,40.73 83.99,41.57 83.99,45.53 82.85,46.68 71.87,46.68 v69.92,44.99 | v66.08,44.99 63.37,46.84 60.48,49.54 51.37,49.54 46.3,54.8 35.12,54.8 34.85,54.52
  Bottom 0.406: v69.92,44.99 v66.08,44.99
BATTERY_THRMSTOR_+V  (via drill 0.38, 0.6)  (1 unrouted)
  Top 0.406: H1.8 20.67,82.58 20.67,53.33 22.27,51.73 34.26,51.73 34.61,51.38 34.62,51.38 37.16,53.92 43.82,53.92 44.14,53.6 v44.46,53.6 | U$2.X8 87.13,45.04 83.48,48.7 76.27,48.7 75.87,48.67 70.17,48.67 v69.9,48.59 | v66.09,48.57 64.27,48.97 60.95,51.08 52.09,51.08 52.08,51.06 47.63,55.51 v47,55.51
  Bottom 0.406: v69.9,48.59 66.96,48.6 v66.09,48.57 | v47,55.51 45.09,53.6 v44.46,53.6
BATTERY_THRMSTOR_-V  (via drill 0.38, 0.6)
  Top 0.406: H1.10 23.29,82.66 23.29,54.98 24.73,53.53 33.77,53.53 34.43,52.88 34.62,52.97 v34.93,53.28 | U$2.X9 84.79,42.39 84.79,46.04 83.2,47.63 72.06,47.63 v69.89,46.78 | v66.12,46.77 63.84,47.8 61.85,49.38 v61.92,49.47 | v37.47,55.82 46.05,55.82 46.68,56.46 52.4,56.46 v55.25,53.6 | v62.24,54.87 v59.7,54.87
  Bottom 0.406: v69.89,46.78 67.01,46.8 v66.12,46.77 | v37.47,55.82 v34.93,53.28 | v55.25,53.6 58.43,53.6 v59.7,54.87 | v62.24,54.87 62.24,49.79 v61.92,49.47
BOTTOM_TEMP_SOLAR_PANEL-1  (via drill 0.6)
  Top 0.254: v25.25,34.79 24.86,34.5 24.74,34.41
  Top 0.305: 24.74,34.41 ADC_TEMP_2.14
  Top 0.406: R5.1 C15.2 29.4,23.63 30.86,23.63 30.86,34.03 30.07,34.82 25.18,34.82 24.86,34.5
  Bottom 0.406: H2.9 23.29,85.19 23.29,47.06 25.19,45.15 25.23,44.98 25.28,43.63 v25.24,34.8 v25.25,34.79
BOTTOM_TEMP_SOLAR_PANEL-2  (via drill 0.6)
  Top 0.254: v26.27,33.84 25.9,33.75 25.57,33.74 | 22.11,33.74 ADC_TEMP_2.13
  Top 0.305: 25.57,33.74 22.11,33.74
  Top 0.406: R8.1 C12.2 26.32,23.84 v27.71,23.84 | v27.67,28.56 27.67,30.99 28.71,32.03 28.71,33.44 28.32,33.82 v26.28,33.82 v26.27,33.84
  Bottom 0.406: H2.11 25.83,85.19 25.83,68.54 24.99,67.71 24.99,46.76 26.01,45.75 26.01,45.7 26.31,45.39 26.31,33.88 v26.27,33.84 | v27.71,23.84 27.71,28.56 v27.67,28.56
BOTTOM_TEMP_SOLAR_PANEL-3  (via drill 0.6)
  Top 0.254: v27.81,32.84 27.48,32.76 26.82,33.11 24.69,33.11 | 22.17,33.11 ADC_TEMP_2.12
  Top 0.305: 24.69,33.11 22.17,33.11
  Top 0.406: R10.1 C9.2 23.29,23.72 v24.76,23.72 | v24.77,28.61 24.77,33.05 24.69,33.11
  Bottom 0.406: H2.13 28.37,85.19 28.37,68.94 26.25,66.83 26.25,46.91 27.27,45.9 27.27,34.91 27.92,34.26 27.92,32.95 v27.81,32.84 | v24.76,23.72 24.76,28.61 v24.77,28.61
BOTTOM_TEMP_SOLAR_PANEL-4  (via drill 0.6)
  Top 0.305: ADC_TEMP_2.11 22.77,32.46 22.77,30.21 v22.34,29.78
  Top 0.406: R12.1 C7.2 20.18,23.67 v21.77,23.67
  Bottom 0.406: H2.15 30.91,85.19 30.91,69.02 28.05,66.17 28.05,47.94 27.57,47.46 27.57,46.65 28.22,46 28.22,34.96 29.43,33.75 29.43,30.12 29.22,29.91 22.43,29.87 v22.34,29.78 21.77,29.21 v21.77,23.67
ELEC_BAY_TEMP_0  (via drill 0.6)
  Top 0.254: R22.1 53.62,30.22 54.45,31.04 54.45,32.46 | ADC_TEMP_1.11
  Top 0.305: 54.45,32.46 54.01,32.9 ADC_TEMP_1.11
  Top 0.406: R20.1 50.88,21.94 C16.2 50.88,23.6 v52.52,23.6
  Bottom 0.406: v52.52,23.6 52.52,28.68 R22.1
EXTERNAL_POWER_+V
  Bottom 0.406: H2.51 79.88,86.43 81.16,85.15 81.27,85.03
  Bottom 0.813: U$1.X4 81.78,71.99 83.36,73.57 83.36,82.95 81.16,85.15
EXTERNAL_POWER_GND
  Bottom 0.406: H2.52 80.84,88.97 81.82,88
  Bottom 0.813: U$1.X3 82.06,67.99 84.83,70.75 84.83,84.99 81.82,88
GND  (via drill 0.38, 0.6)
  Top 0.254: C11.2 10.13,38.35 C13.2 12.29,39.62 11.89,40.01 8.37,40.01 v8.32,40.07 | C5.2 C6.2 57.84,39.51 v58.37,40.04 | 3.94,38.42 10.07,38.42
  Top 0.305: ADC_TEMP_2.15 22.69,35.06 v23.72,35.22 | 3.94,38.42 3.19,37.66 D1.A 5.13,35.15 C3.2 | 10.07,38.42 C11.2
  Top 0.406: C24.1 C14.1 11.01,27.05 C10.1 C8.1 C7.1 C9.1 C12.1 26.32,27.03 C15.1 29.4,28.32 v29.7,28.63 | U$4.48 76.02,43.05 75.99,43.03 | C22.1 60.49,26.98 C20.1 C18.1 C16.1 C17.1 C19.1 C21.1 C23.1 37.79,26.93 36.52,26.93 | 34.62,31.38 34.62,29.47 C4.1 34.62,29.15 34.62,28.84 36.52,26.93 | v35.57,41.85 36.2,41.22 36.2,40.9 36.84,40.27 R21.2 | 34.3,31.69 v33.03,32.96 | v19.37,6.61 19.37,6.93 20.01,7.56 U1.4 | 41.92,13.6 42.87,14.55 43.82,14.55 U$3.2 | 41.6,13.6 41.92,13.6 | 41.6,11.06 41.6,11.37 C1.2 41.6,11.69 41.6,13.6 | 41.6,13.6 R1.2 | 41.92,13.6 R1.2 | 36.52,26.93 36.52,21.53 v36.2,21.22 | v40.01,14.23 40.97,14.23 41.28,13.91 R1.2 | C2.2 17.36,16.69 v16.46,17.59
  GND 0.254: v8.32,40.07 8.32,40.9 8.3,40.92 | v23.72,35.22 23.66,35.49 23.93,35.68 | v58.37,40.04 58.76,40.04 59.06,40.34
  GND 0.406: v29.7,28.63 29.7,29.06 29.58,29.19
  Bottom 0.406: v35.57,41.85 32.71,39 32.39,39 31.76,38.36 31.76,34.23 v33.03,32.96 30.17,30.11 30.17,29.15 29.85,28.84 v29.7,28.63 | v19.37,6.61 20.96,8.2 21.91,8.2 U$6.- 22.23,8.2 25.73,4.71 v32.08,4.71 | v36.2,21.22 34.62,19.63 34.62,18.99 39.38,14.23 v40.01,14.23 | v16.46,17.59 16.46,17.61 16.36,17.71
  pour GND: 0.01,91.91 90.79,91.91 90.79,-0.46 0.05,-0.46
MECH_DEPLOY_SWITCH_+V  (via drill 0.6)
  Top 0.406: U$2.X4 85.27,58.19 69.61,58.19 v69.54,58.12 | v66.07,58.12 55.71,58.12 53.69,60.15 53.69,85.21 H2.31
  Bottom 0.406: v69.54,58.12 v66.07,58.12
MECH_DEPLOY_SWITCH_-V  (via drill 0.6)
  Top 0.406: U$2.X5 84.69,53.6 69.77,53.6 v69.88,53.91 | v66.05,53.92 57.25,53.87 v56.24,54.61
  Bottom 0.406: H2.33 56.3,85.13 56.3,77.11 56.24,77.05 v56.24,54.61 | v69.88,53.91 66.05,53.9 v66.05,53.92
N$3  (via drill 0.6)
  Top 0.254: 51.97,35.49 v51.68,35.2 | v37.48,33.89 R3.2
  Top 0.305: ADC_TEMP_1.15 51.97,35.49
  Bottom 0.254: v51.68,35.2 51.16,35.2 49.85,33.89 v37.48,33.89
N$7
  Top 0.406: R2.1 24.2,14.07 25.34,12.93 26.27,12.93 26.73,12.47 26.73,11.88 26.39,11.54 24.81,11.54 U1.8
N$8  (via drill 0.38)
  Top 0.406: v16.52,9.15 19.69,9.15 U1.3 20.01,9.15 21.28,9.15 24.14,6.29 v26.68,6.29
  Bottom 0.406: v16.52,9.15 15.25,9.15 14.29,8.2 U$6.+$1 | v36.2,4.71 32.71,8.2 30.49,8.2 U$6.+$2 30.17,7.88 28.58,6.29 v26.68,6.29
N$10  (via drill 3.2)
  other vias: 9.08,88.82
N$12
  Top 0.406: U1.1 11.24,11.49 arc90 Q1.1
N$14  (via drill 3.2)
  other vias: 85.25,3.12
N$16  (via drill 3.2)
  other vias: 5.29,3.12
N$18
  Top 0.406: U1.2 12.51,10.22 Q1.2
PA3_PC_RS232  (via drill 0.38)
  Top 0.406: H1.25 44.85,70.94 45.41,70.94 v45.41,67.57 | U$4.41 82.77,39.24 83.16,38.85 83.16,26.81 83.66,26.3 85.85,26.3 88.37,23.79 88.37,7.98 v87,6.62 | v87,6.62 86.86,6.48 | v60.65,12.64 62.87,10.42 62.87,9.47 68.9,3.44 v79.7,3.44 | v87,6.61 v87,6.62
  Bottom 0.406: v45.41,67.57 45.41,61.22 47.95,58.68 47.95,46.93 60.65,34.23 v60.65,12.64 | v79.7,3.44 81.92,3.44 85.1,6.61 v87,6.61
PAYLOAD_TEMP  (via drill 0.38, 0.6)
  Top 0.254: ADC_TEMP_1.10 46.36,32.89
  Top 0.406: R19.1 C17.2 47.68,23.44 v49.26,23.44 | 46.36,32.96 46.36,32.89 46.36,30.11 47.31,29.15 47.31,28.84 47.95,28.2 v49.22,28.2 52.4,28.2 v53.35,29.15 | v57.48,43.12 v53.98,39.63 | v55.89,46.3 57.16,46.3 v57.79,46.93 | v54.94,55.19 55.57,55.82 v57.16,55.82 | v66.68,72.33 v59.7,65.35
  Bottom 0.406: H2.50 74.05,87.8 74.05,79.65 73.99,79.64 v66.68,72.33 | v49.26,23.44 49.26,28.2 | 49.26,28.2 49.26,28.28 | v49.22,28.2 49.26,28.2 | v53.35,29.15 53.35,33.6 53.98,34.23 v53.98,39.63 | v57.48,43.12 55.89,44.71 v55.89,46.3 | v57.79,46.93 54.3,50.43 54.3,54.55 v54.94,55.19 | v57.16,55.82 57.16,62.81 v59.7,65.35
PC_PA3_RS232  (via drill 0.6)
  Top 0.406: U$4.43 82.81,40.51 83.9,39.53 83.9,27.48 84.29,27 86.97,27 v88.16,25.8 | v44.65,48.78 60.23,48.78 66.45,42.76 66.48,11.98 66.81,11.64 66.84,11.64 70.52,7.96 82.7,7.96 v82.63,8.35
  Bottom 0.406: v88.16,25.8 86.72,25.8 85.84,24.92 85.84,10.92 83.15,8.23 v82.63,8.35 | H1.21 39.77,47.69 41.25,46.21 43.93,46.21 44.52,46.81 44.52,49.05 v44.65,48.78
PC_Q6_RS232  (via drill 0.6)
  Top 0.406: U$4.44 v77.09,40.51 76.39,40.51 76.38,40.5 | U$2.X2 85.03,65.95 77.19,65.95 | 77.19,65.95 77.09,65.95 | v75.79,65.95 77.18,65.95 77.19,65.95
  Bottom 0.406: v77.09,40.51 75.63,40.51 75.29,40.84 75.29,65.45 v75.79,65.95
POW_3V3
  Bottom 0.406: H1.16 33.47,82.58 35.98,82.58 37.23,83.83 H1.20
POW_5V  (via drill 0.38)
  Top 0.406: H1.26 H1.28 46.14,83.91 46.14,76.52 46.05,76.46 v50.17,72.33 | U$4.50 U$4.49 | v45.41,15.5 46.36,15.5 U$3.5 46.68,15.5 50.17,18.99 v61.6,18.99 | v40.01,12.96 40.01,11.69 C1.1 39.7,11.69 | v72.71,38.04 68.9,34.23 v68.9,26.3 | v55.25,60.59 56.84,59 v62.24,59 | v70.18,55.19 75.57,55.19 v76.21,54.55
  Bottom 0.406: v45.41,15.5 42.55,15.5 v40.01,12.96 | 80.02,44.39 80.34,44.39 U$4.50 80.02,44.39 | 80.02,44.39 78.75,43.12 78.75,38.36 75.89,35.5 75.26,35.5 v72.71,38.04 | v61.6,18.99 v68.9,26.3 | v50.17,72.33 55.25,67.25 v55.25,60.59 | v62.24,59 66.05,55.19 v70.18,55.19 | v76.21,54.55 76.21,48.2 80.02,44.39
POW_9V
  Top 0.406: H1.22 H1.24
POW_BATT_GND  (via drill 0.6)
  Top 0.406: H1.33 55.01,62.3 57.23,60.07 57.42,60.06 v65.84,60.06 | U$1.X1 80.71,60.07 70.11,60.07 v70.05,60.06
  Bottom 0.406: v70.05,60.06 65.96,60.06 v65.84,60.06
POW_BATT_VOUT  (via drill 0.6)
  Top 1.016: H1.35 57.57,81.35 57.57,64.83 58.4,63.99 65.86,63.99 v65.88,64.02 | v69.83,64.02 80.76,64.02 U$1.X2
  Bottom 1.016: v65.88,64.02 v69.83,64.02
POW_RADIO_GND
  Top 0.406: H2.29 H2.30 H2.32
POW_RADIO_VBATT
  Bottom 0.406: H2.45 H2.46
PWR_CTRL  (via drill 0.38)
  Top 0.406: R1.1 41.6,15.5 43.82,15.5 U$3.1 44.14,15.5 v45.41,16.77
  Bottom 0.406: U$4.45 82.42,41.78 83.01,41.19 83.01,30.97 85.88,28.11 87.22,28.11 89.38,25.95 89.38,25.4 88.41,24.44 87.26,24.44 86.65,23.83 86.65,10.11 81.67,5.12 60.8,5.12 60.65,5.02 57.16,5.02 v45.41,16.77
Q6_AIN_0  (via drill 0.38)  (1 unrouted)
  Top 0.406: H1.39 62.63,72.51 63.19,72.51 v63.19,72.33 | U$4.3 82.81,15.11 83.13,14.78 83.13,12.57 82.56,12 | 82.56,12 82.55,11.99 | v72.4,45.66 73.67,44.39 73.67,37.73 72.71,36.77 72.71,17.09 77.79,12.01 82.56,12.01 82.56,12
  Bottom 0.406: v72.4,45.66 72.4,63.13 v63.19,72.33
Q6_AIN_1
  Top 0.406: U$4.5 83.24,16.38 83.89,15.73 83.89,12.09 81.85,10.05 71.57,10.05 68.04,13.43 H1.43
Q6_AOUT_0  (via drill 0.38)
  Top 0.406: H1.47 72.79,71.61 73.99,71.61 | 73.99,71.61 74.02,71.61 | U$4.4 75.77,15.11 75.47,15.4 | 75.47,15.4 75.45,15.42 | v76.52,42.17 74.3,39.95 74.3,37.41 73.35,36.46 73.35,17.72 75.57,15.5 75.47,15.4 | v80.02,45.66 v78.75,44.39 | v75.89,71.06 74.62,71.06 73.99,71.7 73.99,71.61
  Bottom 0.406: v78.75,44.39 v76.52,42.17 | v80.02,45.66 80.02,53.6 76.84,56.78 76.84,70.11 v75.89,71.06
Q6_AOUT_1  (via drill 0.38)
  Top 0.406: H1.51 77.87,73.06 76.52,73.06 | 76.52,73.06 76.5,73.06 | U$4.6 75.96,16.38 75.57,16.77 | 75.57,16.77 75.5,16.84 | 75.57,16.77 75.57,20.58 73.99,22.17 73.99,36.14 75.26,37.41 v75.26,38.04 | 75.57,16.77 | v76.52,72.97 76.52,73.06
  Bottom 0.406: v75.26,38.04 73.35,39.95 73.35,69.79 v76.52,72.97
Q6_GPIO_0  (via drill 0.38)
  Top 0.406: H1.13 29.61,72.76 30.8,72.76 30.8,58.36 v33.66,55.51 | v62.55,13.6 46.68,13.6 U$3.4 | v37.47,48.2 40.33,48.2 42.23,46.3 v51.12,46.3 | v57.48,40.9 58.11,41.54 59.38,41.54 v62.55,38.36 | v71.76,13.6 v71.76,29.15
  Bottom 0.406: v62.55,13.6 v71.76,13.6 79.07,13.6 80.02,12.64 81.92,12.64 82.88,13.6 82.88,19.31 81.92,20.26 U$4.11 | v33.66,55.51 33.66,52.01 v37.47,48.2 | v51.12,46.3 56.52,40.9 v57.48,40.9 | v71.76,29.15 v62.55,38.36
Q6_GPIO_2  (via drill 0.6)
  Top 0.406: U$4.15 84.78,22.73 86.19,21.32 86.19,10.24 82.53,6.58 70.24,6.58 65.67,11.16 65.67,41.88 59.74,47.8 v42.3,47.8
  Bottom 0.406: H2.24 41.07,87.74 41.07,49.02 v42.3,47.8
Q6_GPIO_6  (via drill 0.38, 0.6)
  Top 0.406: v64.93,8.9 63.54,10.3 63.54,40.13 59.5,44.17 24.31,44.17 21.99,46.49 v21.91,46.62
  Bottom 0.406: U$4.23 82.75,27.81 84.29,26.26 84.29,12.54 80.66,8.9 v64.93,8.9 | v21.91,46.62 22.55,47.25 22.55,49.47 21.91,50.11 21.91,81.22 H1.7
Q6_GPIO_7  (via drill 0.38, 0.6)
  Top 0.406: v67.84,7.08 66.53,8.39 66.5,9.09 64.6,10.85 64.6,40.69 59.98,45.31 26.07,45.31 24.53,46.86 24.46,46.93 24.14,47.25 v24.14,47.57
  Bottom 0.406: U$4.25 83.58,29.08 85.13,27.52 85.13,11.65 84.34,11.66 84.32,11.64 84.32,11.62 81.7,9 81.7,7.08 v67.84,7.08 | v24.14,47.57 24.14,67.89 24.46,68.21 24.46,81.22 H1.9
Q6_GPIO_8  (via drill 0.38)
  Top 0.406: H1.11 27.07,71.24 28.9,71.24 28.9,71.06 29.85,70.11 v29.85,66.62 | v48.9,49.79 45.41,49.79 43.19,52.01 v41.92,52.01 | v31.76,66.94 v41.92,56.78
  Bottom 0.406: v48.9,49.79 56.52,42.17 57.79,42.17 59.38,40.58 59.38,40.27 79.38,20.26 80.34,20.26 U$4.12 | v41.92,56.78 v41.92,52.01 | v31.76,66.94 30.17,66.94 v29.85,66.62
Q6_GPIO_10  (via drill 0.38)
  Top 0.406: H1.32 51.18,82.62 51.18,76.78 | 51.18,76.78 51.18,76.66 | U$4.16 76.18,22.73 75.61,23.31 | v61.6,57.09 58.11,57.09 57.79,57.41 55.25,57.41 51.12,61.54 51.12,76.78 51.18,76.78
  Bottom 0.406: v61.6,57.09 63.19,55.51 63.19,45.03 77.48,30.74 77.48,25.34 80.02,22.8 80.34,22.8 U$4.16
Q6_GPIO_13  (via drill 0.38)
  Top 0.406: H1.36 56.29,82.65 56.29,74.12 56.2,73.92 56.2,64.71 58.11,62.81 59.7,62.81 v61.6,60.9 | U$4.22 77.04,26.54 76.74,26.83 | 76.74,26.83 76.7,26.88 | v75.57,36.46 75.57,28.2 76.84,26.93 76.74,26.83
  Bottom 0.406: v75.57,36.46 71.13,40.9 71.13,55.51 69.54,57.09 65.41,57.09 v61.6,60.9
Q6_GPIO_14  (via drill 0.38)
  Top 0.406: H1.38 58.76,82.58 58.76,74.87 | 58.76,74.87 58.76,74.77 | U$4.24 77.15,27.81 76.87,28.09 76.84,28.2 v76.52,28.52 | v58.74,74.87 58.76,74.87
  Bottom 0.406: v76.52,28.52 60.33,44.71 60.33,54.24 60.65,54.55 60.65,72.97 v58.74,74.87
Q6_GPIO_15  (via drill 0.38)
  Top 0.406: H1.40 61.38,82.66 61.38,75.53 v61.29,75.51 | U$4.26 77.34,29.08 | 77.34,29.08 77.26,29.16 | v77.48,32.01 77.48,29.15 77.34,29.08 | v68.9,44.08 68.9,57.09 68.59,57.41 68.59,67.57 v68.9,67.89
  Bottom 0.406: v77.48,32.01 68.9,40.58 v68.9,44.08 | v61.29,75.51 v68.9,67.89
Q6_I2C_SCL_1  (via drill 0.38, 0.5, 0.6)
  Top 0.254: 30.14,37.66 30.62,38.14 | 50.95,38.09 v50.92,38.13
  Top 0.305: ADC_TEMP_2.19 30.14,37.66 | ADC_TEMP_1.19 50.95,38.09 | v33.84,37.86 33.24,37.91 33.02,38.13 30.62,38.13 30.62,38.14
  Top 0.406: U$4.13 84.32,21.46 85.37,20.41 85.37,10.94 84.5,10.07 | 84.5,10.07 84.41,9.98 | v69.22,10.74 70.81,9.15 81.92,9.15 82.24,9.47 83.83,9.47 84.46,10.1 84.5,10.07 | v56.2,10.74 54.3,12.64 v52.08,12.64 | U1.6 28.82,8.95 29.56,9.7 29.56,13.31 v35.57,19.31
  Bottom 0.254: v50.92,38.13 38.75,38.13
  Bottom 0.305: 38.75,38.13 38.5,38.13 34.14,38.13 v33.84,37.86
  Bottom 0.406: H2.20 38.5,87.69 38.5,38.13 | v35.57,19.31 38.74,22.49 39.7,22.49 40.97,23.76 | 40.97,23.76 42.23,25.03 42.23,29.15 46.36,33.28 50.81,33.28 51.76,34.23 52.08,34.23 52.71,34.87 52.71,37.41 51.76,38.36 51.12,38.36 v50.92,38.13 | v56.2,10.74 v69.22,10.74 | 40.97,23.76 v52.08,12.64
Q6_I2C_SDA_1  (via drill 0.38, 0.6)
  Top 0.254: 30.8,37.01 30.82,37.01 31.17,37.36 31.19,37.38 | 52.07,37.44 v51.66,37.03
  Top 0.305: ADC_TEMP_2.18 30.8,37.01 | 52.07,37.44 ADC_TEMP_1.18 53.4,37.44 54.35,37.44
  Top 0.406: H2.18 33.36,87.65 33.36,76.64 33.34,76.46 v33.34,75.19 | U$4.14 76.17,21.46 75.44,22.19 75.26,22.17 v74.94,22.49 | v32.08,19.31 31.76,18.99 30.17,18.99 25.9,14.73 v25.9,14.64 | 54.35,37.44 v56.52,39.63 | v32.71,37.09 32.39,37.41 31.12,37.41 31.17,37.36 | v30.8,37.09 30.8,37.01 | U1.5 27.29,7.68 v27.42,7.8
  Bottom 0.254: v51.66,37.03 38.42,37.03 32.7,37.03 32.68,37.06 32.45,37.28
  Bottom 0.406: v32.08,19.31 32.08,30.74 38.42,37.09 38.42,37.03 | v74.94,22.49 58.43,39 57.16,39 v56.52,39.63 | v32.71,37.09 32.68,37.06 | v33.34,75.19 33.34,56.46 30.8,53.92 v30.8,37.09 | v27.42,7.8 27.42,13.13 v25.9,14.64
Q6_PC_RS232  (via drill 0.6)
  Top 0.406: U$4.42 v77.55,39.24 76.31,39.24 | U$2.X1 85.15,70.07 77.55,70.07 77.54,70.06 75.18,70.06 74.57,69.46 v74.57,67.7
  Bottom 0.406: v77.55,39.24 75.18,39.24 74.49,39.93 74.49,67.62 v74.57,67.7
Q6_SPI_CS0  (via drill 0.38)
  Top 0.406: H2.14 30.9,87.68 30.9,74.82 31.6,74.12 32.61,74.12 32.71,74.24 33.66,74.24 v46.36,61.54 | U$4.20 76.83,25.27 76.48,25.62 | 76.48,25.62 76.41,25.69 | v74.94,27.25 76.52,25.66 76.48,25.62
  Bottom 0.406: v74.94,27.25 56.84,45.35 56.84,46.93 48.59,55.19 48.59,59.32 v46.36,61.54
Q6_SPI_CS1  (via drill 0.38)
  Top 0.406: v31.12,13.28 v36.52,18.68 | v20.01,39.31 14.93,44.39 v14.93,47.57
  Bottom 0.406: H2.12 25.76,87.67 13.46,87.67 10.59,84.8 7.01,84.8 6.99,84.72 6.99,61.22 15.25,52.97 15.25,48.52 14.93,48.2 v14.93,47.57 | U$4.21 82.82,26.54 83.54,25.82 83.54,12.94 82.26,11.67 | 82.26,11.67 82.19,11.6 | v36.52,18.68 44.77,18.68 51.76,11.69 82.24,11.69 82.26,11.67 | v31.12,13.28 21.91,22.49 21.6,22.49 20.64,23.44 20.64,38.68 v20.01,39.31
Q6_SPI_SCLK  (via drill 0.38)
  Top 0.406: U$4.17 85.26,24 86.98,22.27 86.98,9.47 85.72,8.21 | 85.72,8.21 | v14.29,52.33 24.14,42.49 v24.14,39.31 | v25.75,32.06 25.73,28.84 v26.04,28.52 | v79.38,2.17 79.7,2.17 85.73,8.2 85.72,8.21
  Bottom 0.406: H2.6 17.87,90.54 12.6,90.54 12.45,90.39 12.45,87.62 10.74,85.91 7.63,85.91 | 7.63,85.91 7.52,85.91 | v14.29,52.33 6.04,60.59 6.04,85.03 6.99,85.99 7.63,85.99 7.63,85.91 | v24.14,39.31 21.6,36.77 21.6,34.87 v25.75,32.06 | v26.04,28.52 26.04,24.07 48.27,1.85 79.07,1.85 v79.38,2.17
Q6_SPI_SDI_MISO  (via drill 0.38)
  Top 0.406: H2.10 23.33,87.77 13.56,87.77 10.59,84.8 8.9,84.8 8.9,84.72 5.72,81.54 5.72,59.63 20.01,45.35 v20.01,40.58 | U$4.19 85.5,25.27 87.69,23.07 87.69,8.67 86.48,7.45 | 86.48,7.45 86.42,7.4 | v19.69,31.06 22.23,28.52 v22.87,28.52 | v79.38,0.9 86.05,7.56 86.37,7.56 86.48,7.45
  Bottom 0.406: v20.01,40.58 19.06,39.63 19.06,31.69 v19.69,31.06 | v22.87,28.52 22.87,24.07 46.05,0.9 v79.38,0.9
Q6_SPI_SDO_MOSI  (via drill 0.38)
  Top 0.406: U$4.18 76.52,24 76.17,24.35 | 76.17,24.35 76.04,24.47 | v76.21,24.71 76.21,24.39 76.17,24.35 | v71.45,35.5 v69.86,33.92 | v61.6,55.82 58.43,55.82 57.48,56.78 54.94,56.78 35.88,75.83 35.88,89.48 34.93,90.43 23.5,90.43 22.23,89.16 H2.8
  Bottom 0.406: v76.21,24.71 76.21,27.57 v69.86,33.92 | v71.45,35.5 60.97,45.98 60.97,53.92 61.29,54.24 61.29,55.51 v61.6,55.82
REF_IN  (via drill 0.38, 0.5, 0.6)
  Top 0.305: 48.59,35.5 47.63,35.5 ADC_TEMP_1.6 | D1.C 5.37,31.75 C3.1 7.48,32.48 7.96,32.97 7.96,34.57 8.39,35.05 8.39,35.08 8.76,35.45 10.88,35.45 11.29,35.05 16.21,35.05 ADC_TEMP_2.6 17.28,35.06 17.93,34.41 17.93,30.64 v19.37,29.65 | C4.2 36.91,29.46 v37.55,28.82 | v27.89,14.36 29.13,14.36 v33.52,18.75
  Top 0.406: 36.2,31.38 36.2,29.47 | v50.49,40.58 49.54,41.54 41.6,41.54 R6.1 | 48.59,35.5 v48.9,35.19 v51.44,32.65 | 36.2,29.47 41.92,35.19 v43.51,35.19 | 36.2,29.47 C4.2
  Bottom 0.305: v37.55,28.82 35.75,27.02 33.96,27.02 33.52,26.58 v33.52,18.75 | v19.37,29.65 19.37,18.58 20.42,17.08 25.17,17.08 v27.89,14.36
  Bottom 0.406: v50.49,40.58 53.35,37.73 53.35,34.55 v51.44,32.65 | v48.9,35.19 v43.51,35.19
TEMP_SENSOR2  (via drill 0.38, 0.6)
  Top 0.305: ADC_TEMP_1.9 45.36,33.54 | 45.36,33.54 | 44.95,33.54 45.27,33.54 45.36,33.54
  Top 0.406: R17.1 C19.2 44.63,23.57 v46.32,23.57 | 44.95,33.54 44.46,32.96 44.46,30.74 v46.36,28.84
  Bottom 0.406: v46.32,23.57 46.32,28.68 v46.36,28.84
TEMP_SENSOR_0  (via drill 0.38, 0.6)
  Top 0.254: ADC_TEMP_1.7 44.67,34.84
  Top 0.406: R13.1 C23.2 37.93,23.61 v39.45,23.61 | v39.38,29.15 39.38,29.47 44.77,34.87 44.67,34.84
  Bottom 0.406: v39.45,23.61 39.45,29.08 v39.38,29.15
TEMP_SENSOR_1
  Top 0.254: 55.47,34.84 55.8,34.84 61.52,34.84 62.36,34.01 62.36,23.76 62.33,23.73
  Top 0.305: ADC_TEMP_1.14 55.47,34.84
  Top 0.406: R14.1 C22.2 60.5,23.73 62.33,23.73
TEMP_SENSOR_3  (via drill 0.38, 0.6)
  Top 0.305: ADC_TEMP_1.12 54.3,33.54 54.48,33.56 55.89,32.01
  Top 0.406: R18.1 C18.2 54.07,23.7 v55.8,23.7 | v55.89,29.15 55.89,32.01
  Bottom 0.406: v55.8,23.7 55.8,28.96 | 55.8,28.96 55.67,28.96 | v55.89,29.15 55.8,28.96
THERMALGND1  (via drill 0.38)
  Top 0.254: ADC_TEMP_2.4 ADC_TEMP_2.3 17.73,37 17.73,38.31 | 29.44,38.31 29.83,38.7 29.98,38.71 30.14,38.74 35.25,38.74 46.05,38.74 46.11,38.74 46.17,38.68 46.17,37.6 | ADC_TEMP_1.4 ADC_TEMP_1.3
  Top 0.305: 29.44,38.31 ADC_TEMP_2.20 17.73,38.31 17.47,38.31 ADC_TEMP_2.1 | ADC_TEMP_1.1 46.11,38.74 | ADC_TEMP_1.3 46.33,37.44 46.17,37.6 | 50.81,39.63 51.76,38.68 53.03,38.68 ADC_TEMP_1.20
  Top 0.406: H1.5 19.48,81.34 19.48,73.6 | 19.48,73.6 19.48,73.54 | v49.22,39.63 50.81,39.63 | v46.05,39 46.05,38.74 46.05,38.68 | R21.1 35.25,39.95 35.25,38.74 35.25,38.68 | v40.65,29.47 v43.82,29.47 | v33.03,30.42 33.03,31.69 v31.76,32.96 | v29.85,38.68 29.83,38.7 | v20.33,51.06 19.37,52.01 19.37,73.6 19.48,73.6 | v21.6,47.89 v20.33,49.16 | v17.47,38.36 17.47,38.31
  Bottom 0.406: v49.22,39.63 46.68,39.63 v46.05,39 | v43.82,29.47 47,32.65 47.63,32.65 48.59,31.69 48.59,30.42 R22.2 | v40.65,29.47 39.7,30.42 v33.03,30.42 | v31.76,32.96 29.85,34.87 v29.85,38.68 | v20.33,49.16 v20.33,51.06 | v21.6,47.89 20.01,46.3 20.01,41.85 17.47,39.31 v17.47,38.36
TOP_TEMP_SOLAR_PANEL-1  (via drill 0.6)
  Top 0.254: v9.82,34.43 9.82,34.41
  Top 0.305: 9.82,34.41 ADC_TEMP_2.7
  Top 0.406: R4.1 C24.2 7.9,23.57 v9.28,23.57
  Bottom 0.406: H2.1 12.45,84.52 12.45,77.29 12.27,77.11 12.27,59.04 14.87,56.44 14.87,54.31 15.92,53.25 15.92,43.73 15.12,42.93 11.04,42.93 9.82,41.71 v9.82,34.43 9.28,33.89 v9.28,23.57
TOP_TEMP_SOLAR_PANEL-2  (via drill 0.6)
  Top 0.254: v10.32,32.99 10.76,32.99 11.58,33.76 | ADC_TEMP_2.8
  Top 0.305: 11.58,33.76 ADC_TEMP_2.8
  Top 0.406: R7.1 11.02,25.35 C14.2 11.01,23.56 v12.56,23.56
  Bottom 0.406: H2.3 15.63,85.15 15.63,59.55 15.7,59.48 15.7,55.07 17.12,53.65 17.12,43.42 15.36,41.67 11.55,41.67 10.71,40.83 10.71,33.38 v10.32,32.99 10.12,32.79 10.12,29.4 10.33,29.19 11.72,29.19 12.56,28.35 v12.56,23.56
TOP_TEMP_SOLAR_PANEL-3  (via drill 0.6)
  Top 0.254: v11.54,31.15 12.01,31.55 11.99,33.1 | 16.2,33.1 ADC_TEMP_2.9
  Top 0.305: 11.99,33.1 16.2,33.1
  Top 0.406: R9.1 14.08,21.99 C10.2 14.08,23.58 v15.66,23.58
  Bottom 0.406: H2.5 18.2,85.18 18.2,42.78 16.23,40.81 12.15,40.81 11.55,40.21 11.55,32.55 v11.54,31.15 v11.55,31.14 11.55,30.23 11.69,30.08 11.96,30.08 13.06,28.97 14.81,28.97 15.66,28.13 v15.66,23.58
TOP_TEMP_SOLAR_PANEL-4  (via drill 0.6)
  Top 0.254: 13.04,32.46 v13.04,30.55
  Top 0.305: ADC_TEMP_2.10 13.04,32.46
  Top 0.406: R11.1 17.03,21.98 C8.2 17.03,23.67 v18.22,23.68
  Bottom 0.406: H2.7 20.72,85.16 20.72,77.44 20.64,77.37 20.64,72.57 19.34,71.27 19.34,42.19 16.94,39.79 14.01,39.79 12.9,38.68 12.9,32.32 12.9,30.55 v13.04,30.55 13.78,29.82 17.44,29.82 18.23,28.87 v18.22,23.68

### Text on the board
tDocu: This board is layed out upside-down, when manufactured the blue is top and red is bottom.